# Altium project LIDO_HW_2022_04_V01.PrjPcb (part 2 of 3)

## Sheet LIDO-HW.100.InputStage_2.SchDoc
size A3; SheetNumber: 8; SheetTotal: 17
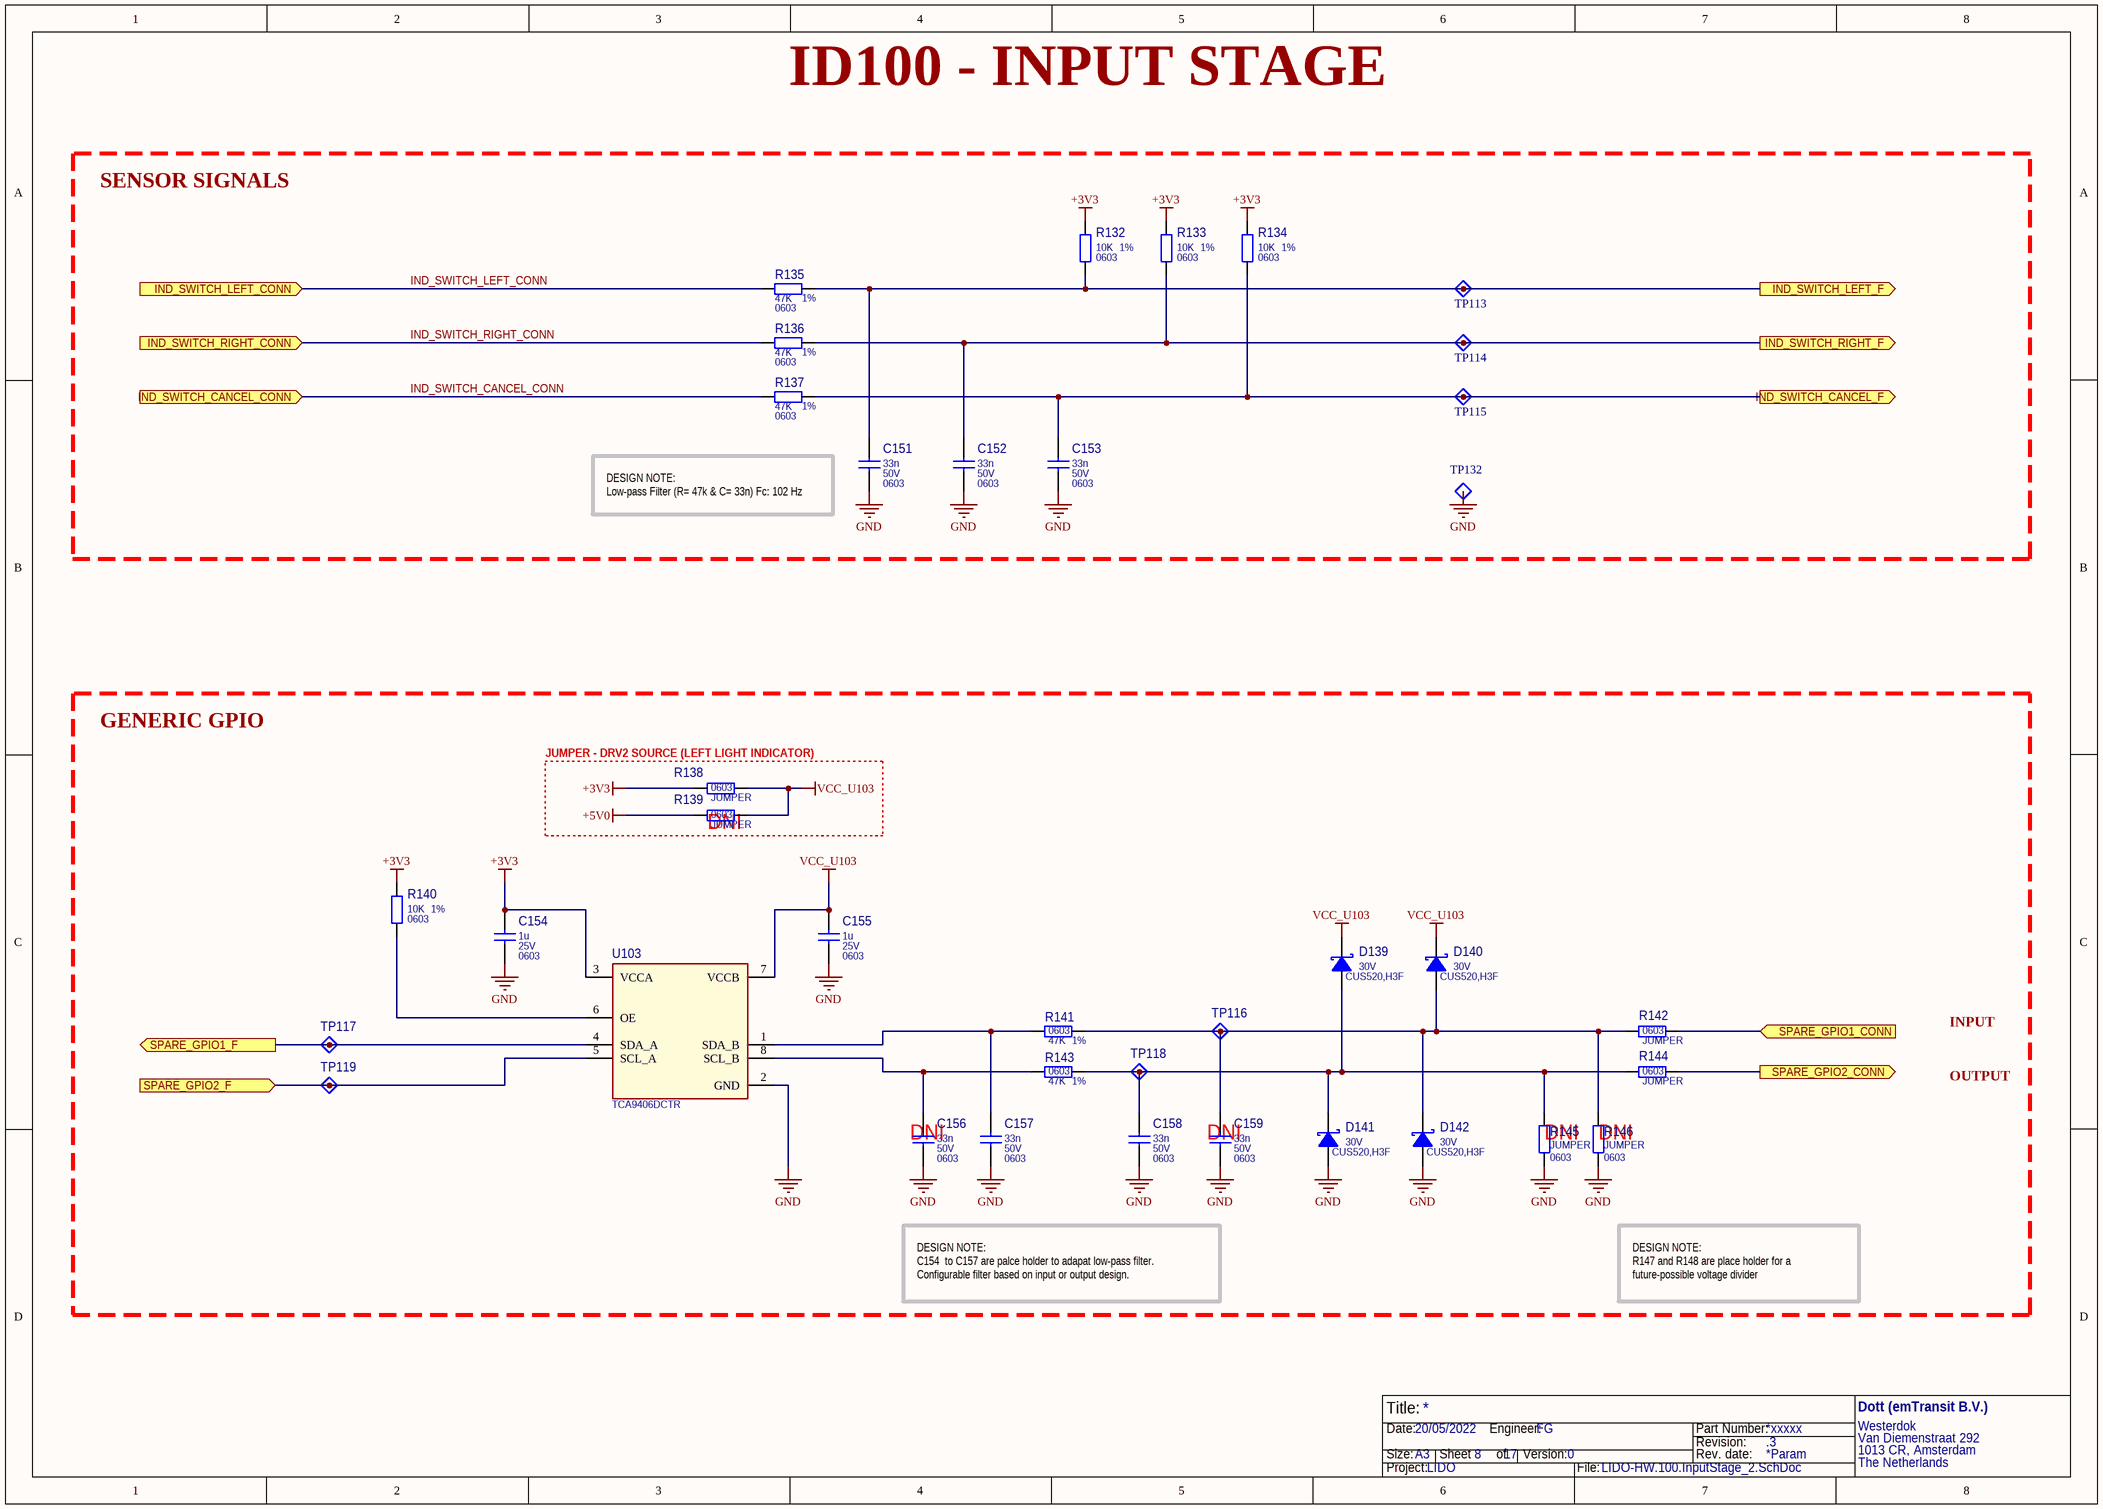
[diagram p7: LIDO-HW.100.InputStage_2.SchDoc]

### Parts
C151  33n  Part Value 2: 50V  Part Package: 0603  [CAP_0603_1608X90-N_MURATA_A]
C152  33n  Part Value 2: 50V  Part Package: 0603  [CAP_0603_1608X90-N_MURATA_A]
C153  33n  Part Value 2: 50V  Part Package: 0603  [CAP_0603_1608X90-N_MURATA_A]
C154  1u  Part Value 2: 25V  Part Package: 0603  [CAP_0603_1608X90-N_MURATA_A]
C155  1u  Part Value 2: 25V  Part Package: 0603  [CAP_0603_1608X90-N_MURATA_A]
C156  33n  Part Value 2: 50V  Part Package: 0603  [CAP_0603_1608X90-N_MURATA_A]
C157  33n  Part Value 2: 50V  Part Package: 0603  [CAP_0603_1608X90-N_MURATA_A]
C158  33n  Part Value 2: 50V  Part Package: 0603  [CAP_0603_1608X90-N_MURATA_A]
C159  33n  Part Value 2: 50V  Part Package: 0603  [CAP_0603_1608X90-N_MURATA_A]
D139  30V  Manufacturer Part Number: CUS520,H3F  [NXP_SOD-323_250X125X95L30x32_A]
D140  30V  Manufacturer Part Number: CUS520,H3F  [NXP_SOD-323_250X125X95L30x32_A]
D141  30V  Manufacturer Part Number: CUS520,H3F  [NXP_SOD-323_250X125X95L30x32_A]
D142  30V  Manufacturer Part Number: CUS520,H3F  [NXP_SOD-323_250X125X95L30x32_A]
R132  10K  Part Value 2: 1%  Part Package: 0603  [RES_0603_1608X60-N_YAGEO_A]
R133  10K  Part Value 2: 1%  Part Package: 0603  [RES_0603_1608X60-N_YAGEO_A]
R134  10K  Part Value 2: 1%  Part Package: 0603  [RES_0603_1608X60-N_YAGEO_A]
R135  47K  Part Value 2: 1%  Part Package: 0603  [RES_0603_1608X60-N_YAGEO_A]
R136  47K  Part Value 2: 1%  Part Package: 0603  [RES_0603_1608X60-N_YAGEO_A]
R137  47K  Part Value 2: 1%  Part Package: 0603  [RES_0603_1608X60-N_YAGEO_A]
R138  JUMPER  Part Package: 0603  [RES_0603_1608X60-N_YAGEO_A]
R139  JUMPER  Part Package: 0603  [RES_0603_1608X60-N_YAGEO_A]
R140  10K  Part Value 2: 1%  Part Package: 0603  [RES_0603_1608X60-N_YAGEO_A]
R141  47K  Part Value 2: 1%  Part Package: 0603  [RES_0603_1608X60-N_YAGEO_A]
R142  JUMPER  Part Package: 0603  [RES_0603_1608X60-N_YAGEO_A]
R143  47K  Part Value 2: 1%  Part Package: 0603  [RES_0603_1608X60-N_YAGEO_A]
R144  JUMPER  Part Package: 0603  [RES_0603_1608X60-N_YAGEO_A]
R145  JUMPER  Part Package: 0603  [RES_0603_1608X60-N_YAGEO_A]
R146  JUMPER  Part Package: 0603  [RES_0603_1608X60-N_YAGEO_A]
TP113  TestPoint_A  [TESTPOINT_1D_A]  (value not drawn)  (no BOM)
TP114  TestPoint_A  [TESTPOINT_1D_A]  (value not drawn)  (no BOM)
TP115  TestPoint_A  [TESTPOINT_1D_A]  (value not drawn)  (no BOM)
TP116  TestPoint_A  [TESTPOINT_1D_A]  (value not drawn)  (no BOM)
TP117  TestPoint_A  [TESTPOINT_1D_A]  (value not drawn)  (no BOM)
TP118  TestPoint_A  [TESTPOINT_1D_A]  (value not drawn)  (no BOM)
TP119  TestPoint_A  [TESTPOINT_1D_A]  (value not drawn)  (no BOM)
TP132  TestPoint_A  [TESTPOINT_1D_A]  (value not drawn)  (no BOM)
U103  TCA9406DCTR  [SSOP8P65_295X400X130L40X25-N_TI_A]

### Blocks framed on the sheet
SENSOR SIGNALS: C151-C153 R132-R137 TP113-TP115 TP132
GENERIC GPIO: C154-C159 D139-D142 R140-R146 TP116-TP119 U103
JUMPER - DRV2 SOURCE (LEFT LIGHT INDICATOR): R138 R139

### Ports
IND_SWITCH_CANCEL_CONN (in), IND_SWITCH_CANCEL_F (out), IND_SWITCH_LEFT_CONN (in), IND_SWITCH_LEFT_F (out), IND_SWITCH_RIGHT_CONN (in), IND_SWITCH_RIGHT_F (out), SPARE_GPIO1_CONN (in), SPARE_GPIO1_F (out), SPARE_GPIO2_CONN (out), SPARE_GPIO2_F (in)

### Nets
+3V3: C154.1 R132.2 R133.2 R134.2 R138.1 R140.2 U103.3(VCCA)
+5V0: R139.1
GND: C151.2 C152.2 C153.2 C154.2 C155.2 C156.2 C157.2 C158.2 C159.2 D141.A D142.A R145.1 R146.1 TP132.1(TP) U103.2(GND)
VCC_U103: C155.1 D139.C D140.C R138.2 R139.2 U103.7(VCCB)
IND_SWITCH_CANCEL_CONN: R137.1 ; port IND_SWITCH_CANCEL_CONN
IND_SWITCH_CANCEL_F: C153.1 R134.1 R137.2 TP115.1(TP) ; port IND_SWITCH_CANCEL_F
IND_SWITCH_LEFT_CONN: R135.1 ; port IND_SWITCH_LEFT_CONN
IND_SWITCH_LEFT_F: C151.1 R132.1 R135.2 TP113.1(TP) ; port IND_SWITCH_LEFT_F
IND_SWITCH_RIGHT_CONN: R136.1 ; port IND_SWITCH_RIGHT_CONN
IND_SWITCH_RIGHT_F: C152.1 R133.1 R136.2 TP114.1(TP) ; port IND_SWITCH_RIGHT_F
SPARE_GPIO1_CONN: R142.2 ; port SPARE_GPIO1_CONN
SPARE_GPIO1_F: TP117.1(TP) U103.4(SDA_A) ; port SPARE_GPIO1_F
SPARE_GPIO2_CONN: R144.2 ; port SPARE_GPIO2_CONN
SPARE_GPIO2_F: TP119.1(TP) U103.5(SCL_A) ; port SPARE_GPIO2_F
NetC156_1: C156.1 R143.1 U103.8(SCL_B)
NetC157_1: C157.1 R141.1 U103.1(SDA_B)
NetC158_1: C158.1 D139.A D141.C R143.2 R144.1 R145.2 TP118.1(TP)
NetC159_1: C159.1 D140.A D142.C R141.2 R142.1 R146.2 TP116.1(TP)
NetR140_1: R140.1 U103.6(OE)

### Notes on the sheet
- ID100 - INPUT STAGE
- DESIGN NOTE:
  Low-pass Filter (R= 47k & C= 33n) Fc: 102 Hz
- INPUT
- OUTPUT
- DESIGN NOTE:
  C154  to C157 are palce holder to adapat low-pass filter.
  Configurable filter based on input or output design.
- DESIGN NOTE:
  R147 and R148 are place holder for a future-possible voltage divider
- Title:
- Size:
- Date:
- A3
- Sheet       of
- Engineer:
- Version:
- Part Number:
- Revision:
- Rev. date:
- Project:
- File:

### Library data of the parts
C151-C153 C156-C159 = 80: CAP CER 0.033UF 50V X7R 0603; Manufacturer Part Number: CGA3E2X7R1H333K080AA; Manufacturer: TDK Corporation; Manufacturer Part Number 2nd: CL10B333KB8WPNC; Manufacturer 2nd: Samsung Electro-Mechanics; Obsolete Part: False; Component ID: 80; Part Value: 33n; Part Value 3: X7R; Package Type: SMT
C154 C155 = 78: CAP CER 1UF 25V X7R 0603; Manufacturer Part Number: CGA3E1X7R1E105M080AE; Manufacturer: TDK Corporation; Obsolete Part: False; Component ID: 78; Part Value: 1u; Part Value 3: X7R; Package Type: SMT
D139-D142 = 17: DIODE SCHOTTKY 30V 200MA; Manufacturer: Toshiba Semiconductor and Storage; Part Package: SOD-323; Obsolete Part: False; Component ID: 17; Part Value: 30V; Part Value 2: 200mA; Package Type: SMT
R132-R134 R140 = 115: RES 10K OHM 1% 1/10W 0603; Manufacturer Part Number: RC0603FR-0710KL; Manufacturer: YAGEO; Obsolete Part: False; Component ID: 115; Part Value: 10K; Part Value 3: 1/10W; Package Type: SMT
R135-R137 R141 R143 = 107: RES SMD 47K OHM 1% 1/10W 0603; Manufacturer Part Number: ERJ-3EKF4702V; Manufacturer: Panasonic Electronic Components; Obsolete Part: False; Component ID: 107; Part Value: 47K; Part Value 3: 1/10W; Package Type: SMT
R138 R139 R142 R144-R146 = 9: RES 0 OHM JUMPER 1/10W 0603; Manufacturer Part Number: RC0603JR-070RL; Manufacturer: YAGEO; Manufacturer Part Number 2nd: RMCF0603ZT0R00; Manufacturer 2nd: Stackpole Electronics Inc; Obsolete Part: False; Component ID: 9; Part Value: JUMPER; Part Value 2: 5%; Part Value 3: 1/10W; Package Type: SMT
TP113-TP119 TP132 = 3: Pad Diamater 1mm; Part: Test Point 1D A; Obsolete Part: False; 00_Name: TP_XXmm; Component ID: 3; 02_Layer: *; 01_Diameter: 1mm
U103 = 6: Voltage Level Translator Bidirectional 1 Circuit 2 Channel 24Mbps SM8; Manufacturer: Texas Instruments; Part Package: MSOP-8; Obsolete Part: False; Component ID: 6; Manufacturer Part Number: TCA9406DCTR; Part Type: Level Translator; Part Value: TCA9406DCTR; Package Type: SMT

## Sheet LIDO-HW.100.OutputStage.SchDoc
size A3; SheetNumber: 9; SheetTotal: 17
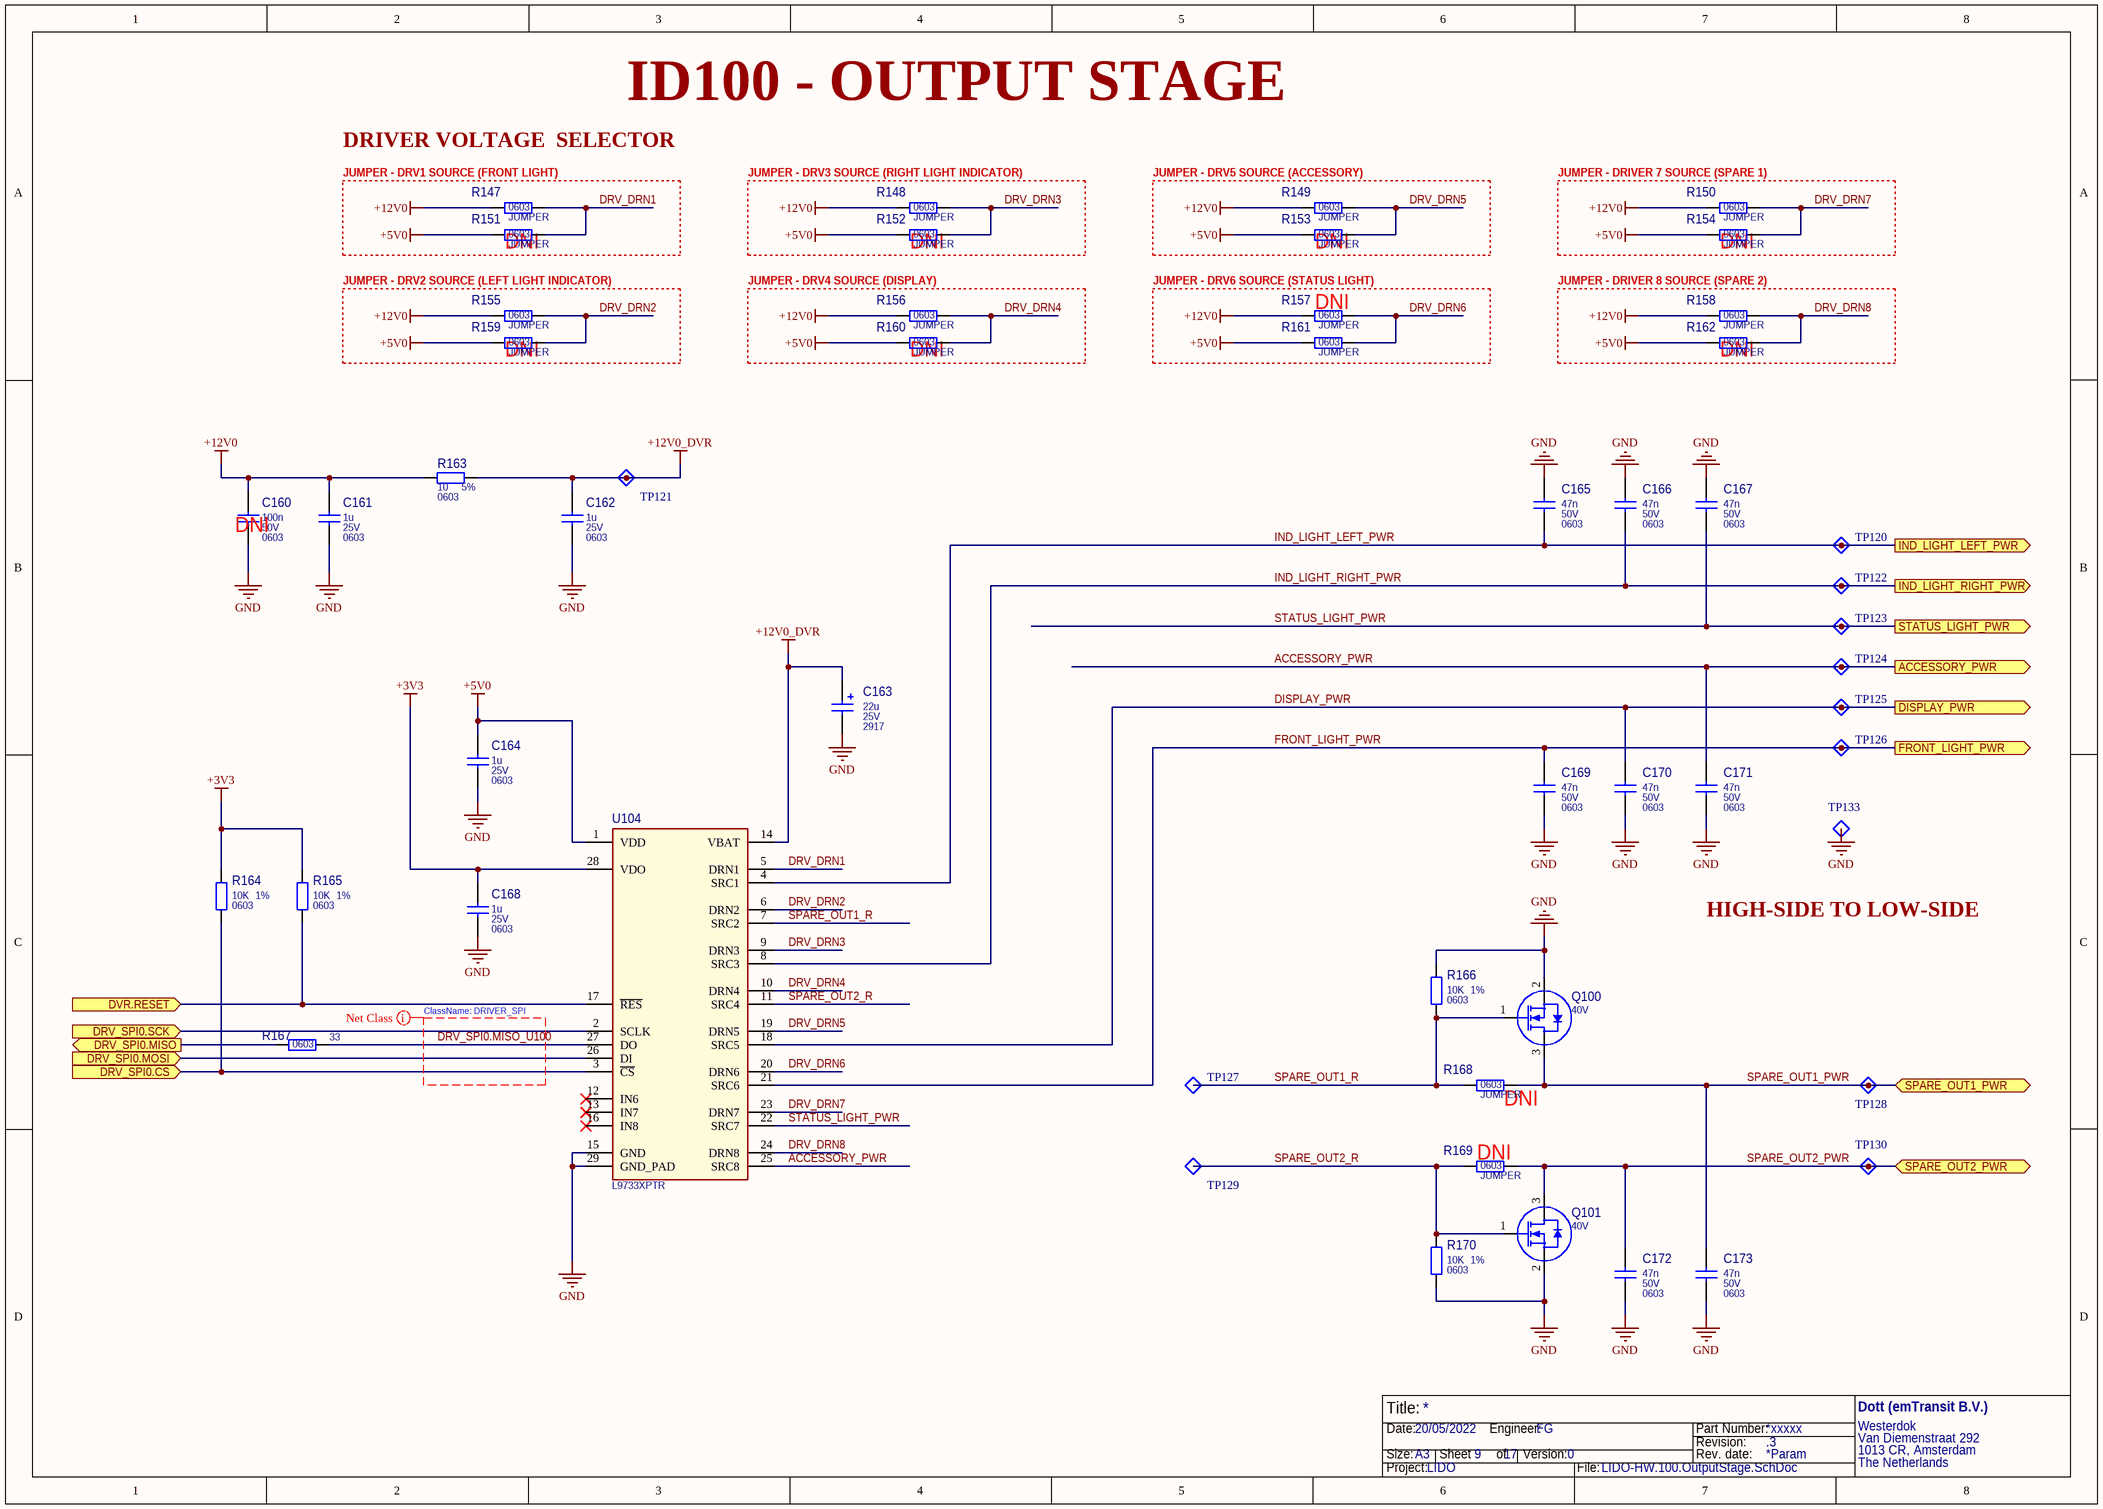
[diagram p8: LIDO-HW.100.OutputStage.SchDoc]

### Parts
C160  100n  Part Value 2: 50V  Part Package: 0603  [CAP_0603_1608X90-N_MURATA_A]
C161  1u  Part Value 2: 25V  Part Package: 0603  [CAP_0603_1608X90-N_MURATA_A]
C162  1u  Part Value 2: 25V  Part Package: 0603  [CAP_0603_1608X90-N_MURATA_A]
C163  22u  Part Value 2: 25V  Part Package: 2917  [CAP_2917_7343X140-N_MURATA_A]
C164  1u  Part Value 2: 25V  Part Package: 0603  [CAP_0603_1608X90-N_MURATA_A]
C165  47n  Part Value 2: 50V  Part Package: 0603  [CAP_0603_1608X90-N_MURATA_A]
C166  47n  Part Value 2: 50V  Part Package: 0603  [CAP_0603_1608X90-N_MURATA_A]
C167  47n  Part Value 2: 50V  Part Package: 0603  [CAP_0603_1608X90-N_MURATA_A]
C168  1u  Part Value 2: 25V  Part Package: 0603  [CAP_0603_1608X90-N_MURATA_A]
C169  47n  Part Value 2: 50V  Part Package: 0603  [CAP_0603_1608X90-N_MURATA_A]
C170  47n  Part Value 2: 50V  Part Package: 0603  [CAP_0603_1608X90-N_MURATA_A]
C171  47n  Part Value 2: 50V  Part Package: 0603  [CAP_0603_1608X90-N_MURATA_A]
C172  47n  Part Value 2: 50V  Part Package: 0603  [CAP_0603_1608X90-N_MURATA_A]
C173  47n  Part Value 2: 50V  Part Package: 0603  [CAP_0603_1608X90-N_MURATA_A]
Q100  40V  [SOT23-3P95_237X112L60-N_ANALOG_A]
Q101  40V  [SOT23-3P95_237X112L60-N_ANALOG_A]
R147  JUMPER  Part Package: 0603  [RES_0603_1608X60-N_YAGEO_A]
R148  JUMPER  Part Package: 0603  [RES_0603_1608X60-N_YAGEO_A]
R149  JUMPER  Part Package: 0603  [RES_0603_1608X60-N_YAGEO_A]
R150  JUMPER  Part Package: 0603  [RES_0603_1608X60-N_YAGEO_A]
R151  JUMPER  Part Package: 0603  [RES_0603_1608X60-N_YAGEO_A]
R152  JUMPER  Part Package: 0603  [RES_0603_1608X60-N_YAGEO_A]
R153  JUMPER  Part Package: 0603  [RES_0603_1608X60-N_YAGEO_A]
R154  JUMPER  Part Package: 0603  [RES_0603_1608X60-N_YAGEO_A]
R155  JUMPER  Part Package: 0603  [RES_0603_1608X60-N_YAGEO_A]
R156  JUMPER  Part Package: 0603  [RES_0603_1608X60-N_YAGEO_A]
R157  JUMPER  Part Package: 0603  [RES_0603_1608X60-N_YAGEO_A]
R158  JUMPER  Part Package: 0603  [RES_0603_1608X60-N_YAGEO_A]
R159  JUMPER  Part Package: 0603  [RES_0603_1608X60-N_YAGEO_A]
R160  JUMPER  Part Package: 0603  [RES_0603_1608X60-N_YAGEO_A]
R161  JUMPER  Part Package: 0603  [RES_0603_1608X60-N_YAGEO_A]
R162  JUMPER  Part Package: 0603  [RES_0603_1608X60-N_YAGEO_A]
R163  10  Part Value 2: 5%  Part Package: 0603  [RES_0603_1608X60-N_YAGEO_A]
R164  10K  Part Value 2: 1%  Part Package: 0603  [RES_0603_1608X60-N_YAGEO_A]
R165  10K  Part Value 2: 1%  Part Package: 0603  [RES_0603_1608X60-N_YAGEO_A]
R166  10K  Part Value 2: 1%  Part Package: 0603  [RES_0603_1608X60-N_YAGEO_A]
R167  33  Part Package: 0603  [RES_0603_1608X60-N_YAGEO_A]
R168  JUMPER  Part Package: 0603  [RES_0603_1608X60-N_YAGEO_A]
R169  JUMPER  Part Package: 0603  [RES_0603_1608X60-N_YAGEO_A]
R170  10K  Part Value 2: 1%  Part Package: 0603  [RES_0603_1608X60-N_YAGEO_A]
TP120  TestPoint_A  [TESTPOINT_1D_A]  (value not drawn)  (no BOM)
TP121  TestPoint_A  [TESTPOINT_1D_A]  (value not drawn)  (no BOM)
TP122  TestPoint_A  [TESTPOINT_1D_A]  (value not drawn)  (no BOM)
TP123  TestPoint_A  [TESTPOINT_1D_A]  (value not drawn)  (no BOM)
TP124  TestPoint_A  [TESTPOINT_1D_A]  (value not drawn)  (no BOM)
TP125  TestPoint_A  [TESTPOINT_1D_A]  (value not drawn)  (no BOM)
TP126  TestPoint_A  [TESTPOINT_1D_A]  (value not drawn)  (no BOM)
TP127  TestPoint_A  [TESTPOINT_1D_A]  (value not drawn)  (no BOM)
TP128  TestPoint_A  [TESTPOINT_1D_A]  (value not drawn)  (no BOM)
TP129  TestPoint_A  [TESTPOINT_1D_A]  (value not drawn)  (no BOM)
TP130  TestPoint_A  [TESTPOINT_1D_A]  (value not drawn)  (no BOM)
TP133  TestPoint_A  [TESTPOINT_1D_A]  (value not drawn)  (no BOM)
U104  L9733XPTR  [SSOP29P65_1030X1030X245L80X27-N_ST_A]

### Blocks framed on the sheet
JUMPER - DRV1 SOURCE (FRONT LIGHT): R147 R151
JUMPER - DRV3 SOURCE (RIGHT LIGHT INDICATOR): R148 R152
JUMPER - DRV5 SOURCE (ACCESSORY): R149 R153
JUMPER - DRIVER 7 SOURCE (SPARE 1): R150 R154
JUMPER - DRV2 SOURCE (LEFT LIGHT INDICATOR): R155 R159
JUMPER - DRV4 SOURCE (DISPLAY): R156 R160
JUMPER - DRV6 SOURCE (STATUS LIGHT): R157 R161
JUMPER - DRIVER 8 SOURCE (SPARE 2): R158 R162

### Ports
ACCESSORY_PWR (out), DISPLAY_PWR (out), DRV_SPI0.CS (in), DRV_SPI0.MISO (out), DRV_SPI0.MOSI (in), DRV_SPI0.SCK (in), DVR.RESET (in), FRONT_LIGHT_PWR (out), IND_LIGHT_LEFT_PWR (out), IND_LIGHT_RIGHT_PWR (out), SPARE_OUT1_PWR (bidir), SPARE_OUT2_PWR (bidir), STATUS_LIGHT_PWR (out)

### Nets
+3V3: C168.1 R164.2 R165.2 U104.28(VDO)
+5V0: C164.1 R151.1 R152.1 R153.1 R154.1 R159.1 R160.1 R161.1 R162.1 U104.1(VDD)
+12V0: C160.2 C161.1 R147.1 R148.1 R149.1 R150.1 R155.1 R156.1 R157.1 R158.1 R163.1
+12V0_DVR: C162.1 C163.1 R163.2 TP121.1(TP) U104.14(VBAT)
GND: C160.1 C161.2 C162.2 C163.2 C164.2 C165.1 C166.1 C167.1 C168.2 C169.2 C170.2 C171.2 C172.2 C173.2 Q100.2(S) Q101.2(S) R166.2 R170.1 TP133.1(TP) U104.15(GND) U104.29(GND_PAD)
ACCESSORY_PWR: C171.1 TP124.1(TP) U104.25(SRC8) ; port ACCESSORY_PWR
DISPLAY_PWR: C170.1 TP125.1(TP) U104.18(SRC5) ; port DISPLAY_PWR
DRV_DRN1: R147.2 R151.2 U104.5(DRN1)
DRV_DRN2: R155.2 R159.2 U104.6(DRN2)
DRV_DRN3: R148.2 R152.2 U104.9(DRN3)
DRV_DRN4: R156.2 R160.2 U104.10(DRN4)
DRV_DRN5: R149.2 R153.2 U104.19(DRN5)
DRV_DRN6: R157.2 R161.2 U104.20(DRN6)
DRV_DRN7: R150.2 R154.2 U104.23(DRN7)
DRV_DRN8: R158.2 R162.2 U104.24(DRN8)
DRV_SPI0.CS: R164.1 U104.3(~{CS}) ; port DRV_SPI0.CS
DRV_SPI0.MISO: R167.1 ; port DRV_SPI0.MISO
DRV_SPI0.MISO_U100: R167.2 U104.27(DO)
DRV_SPI0.MOSI: U104.26(DI) ; port DRV_SPI0.MOSI
DRV_SPI0.SCK: U104.2(SCLK) ; port DRV_SPI0.SCK
DVR.RESET: R165.1 U104.17(~{RES}) ; port DVR.RESET
FRONT_LIGHT_PWR: C169.1 TP126.1(TP) U104.21(SRC6) ; port FRONT_LIGHT_PWR
IND_LIGHT_LEFT_PWR: C165.2 TP120.1(TP) U104.4(SRC1) ; port IND_LIGHT_LEFT_PWR
IND_LIGHT_RIGHT_PWR: C166.2 TP122.1(TP) U104.8(SRC3) ; port IND_LIGHT_RIGHT_PWR
SPARE_OUT1_PWR: C173.1 Q100.3(D) R168.2 TP128.1(TP) ; port SPARE_OUT1_PWR
SPARE_OUT1_R: Q100.1(G) R166.1 R168.1 TP127.1(TP) U104.7(SRC2)
SPARE_OUT2_PWR: C172.1 Q101.3(D) R169.2 TP130.1(TP) ; port SPARE_OUT2_PWR
SPARE_OUT2_R: Q101.1(G) R169.1 R170.2 TP129.1(TP) U104.11(SRC4)
STATUS_LIGHT_PWR: C167.2 TP123.1(TP) U104.22(SRC7) ; port STATUS_LIGHT_PWR

Not connected (* = marked no-connect by the designer): U104 12(IN6)* 13(IN7)* 16(IN8)*

### Layout directives
net class DRIVER_SPI: DRV_SPI0.MISO_U100

### Notes on the sheet
- ID100 - OUTPUT STAGE
- DRIVER VOLTAGE  SELECTOR
- HIGH-SIDE TO LOW-SIDE
- ClassName: DRIVER_SPI
- Title:
- Size:
- Date:
- A3
- Sheet       of
- Engineer:
- Version:
- Part Number:
- Revision:
- Rev. date:
- Project:
- File:

### Library data of the parts
C160 = 77: CAP CER 0.1UF 50V X7R 0603; Manufacturer Part Number: CGA3E2X7R1H104K080AA; Manufacturer: TDK Corporation; Obsolete Part: False; Component ID: 77; Part Value: 100n; Part Value 3: X7R; Package Type: SMT
C161 C162 C164 C168 = 78: as C154 on sheet LIDO-HW.100.InputStage_2; Part Value: 1u; Part Value 3: X7R; Package Type: SMT
C163 = 87: CAP ALUM POLY 22UF 20% 25V SMD; Manufacturer Part Number: ECASD31E226M040KA0; Manufacturer: Murata Electronics; Obsolete Part: False; Component ID: 87; Part Value: 22u; Part Value 3: 20%; Package Type: SMT
C165-C167 C169-C173 = 81: CAP CER 0.047UF 50V X7R 0603; Manufacturer Part Number: GCM188R71H473KA55D; Manufacturer: Murata Electronics; Manufacturer Part Number 2nd: CGA3E2X7R1H473M080AA; Manufacturer 2nd: TDK Corporation; Obsolete Part: False; Component ID: 81; Part Value: 47n; Part Value 3: X7R; Package Type: SMT
Q100 Q101 = 20: MOSFET N-CH 40V 4.6A SOT23; Manufacturer Part Number: DMN4035LQ-13; Manufacturer: Diodes Incorporated; Part Package: SOT23-3; Obsolete Part: False; Component ID: 20; Part Value: 40V; Part Value 2: 40V; Package Type: SMT
R147-R162 R168 R169 = 9: as R138 on sheet LIDO-HW.100.InputStage_2; Part Value: JUMPER; Part Value 2: 5%; Part Value 3: 1/10W; Package Type: SMT
R163 = 109: RES SMD 10 OHM 5% 1/4W 0603; Manufacturer Part Number: ESR03EZPJ100; Manufacturer: Rohm Semiconductor; Obsolete Part: False; Component ID: 109; Part Value: 10; Part Value 3: 1/10W; Package Type: SMT
R164-R166 R170 = 115: as R132-R134 on sheet LIDO-HW.100.InputStage_2; Part Value: 10K; Part Value 3: 1/10W; Package Type: SMT
R167 = 121: RES 33 OHM 5% 1/10W 0603; Manufacturer Part Number: RC0603JR-0733RL; Manufacturer: YAGEO; Obsolete Part: False; Component ID: 121; Part Value: 33; Part Value 2: 5%; Part Value 3: 1/10W; Package Type: SMT
TP120-TP130 TP133 = 3: as TP113-TP119 on sheet LIDO-HW.100.InputStage_2; 02_Layer: *; 01_Diameter: 1mm
U104 = 35: Power Switch/Driver 1:8 N-Channel 1A PowerSSO-28 Exposed Pad; Manufacturer: STMicroelectronics; Part Package: PSSOP-28; Obsolete Part: False; Component ID: 35; Manufacturer Part Number: L9733XPTR; Part Type: Power Switch; Package Type: SMT

## Sheet LIDO-HW.200.MCU_Peripherals_1.SchDoc
size A3; SheetNumber: 10; SheetTotal: 17
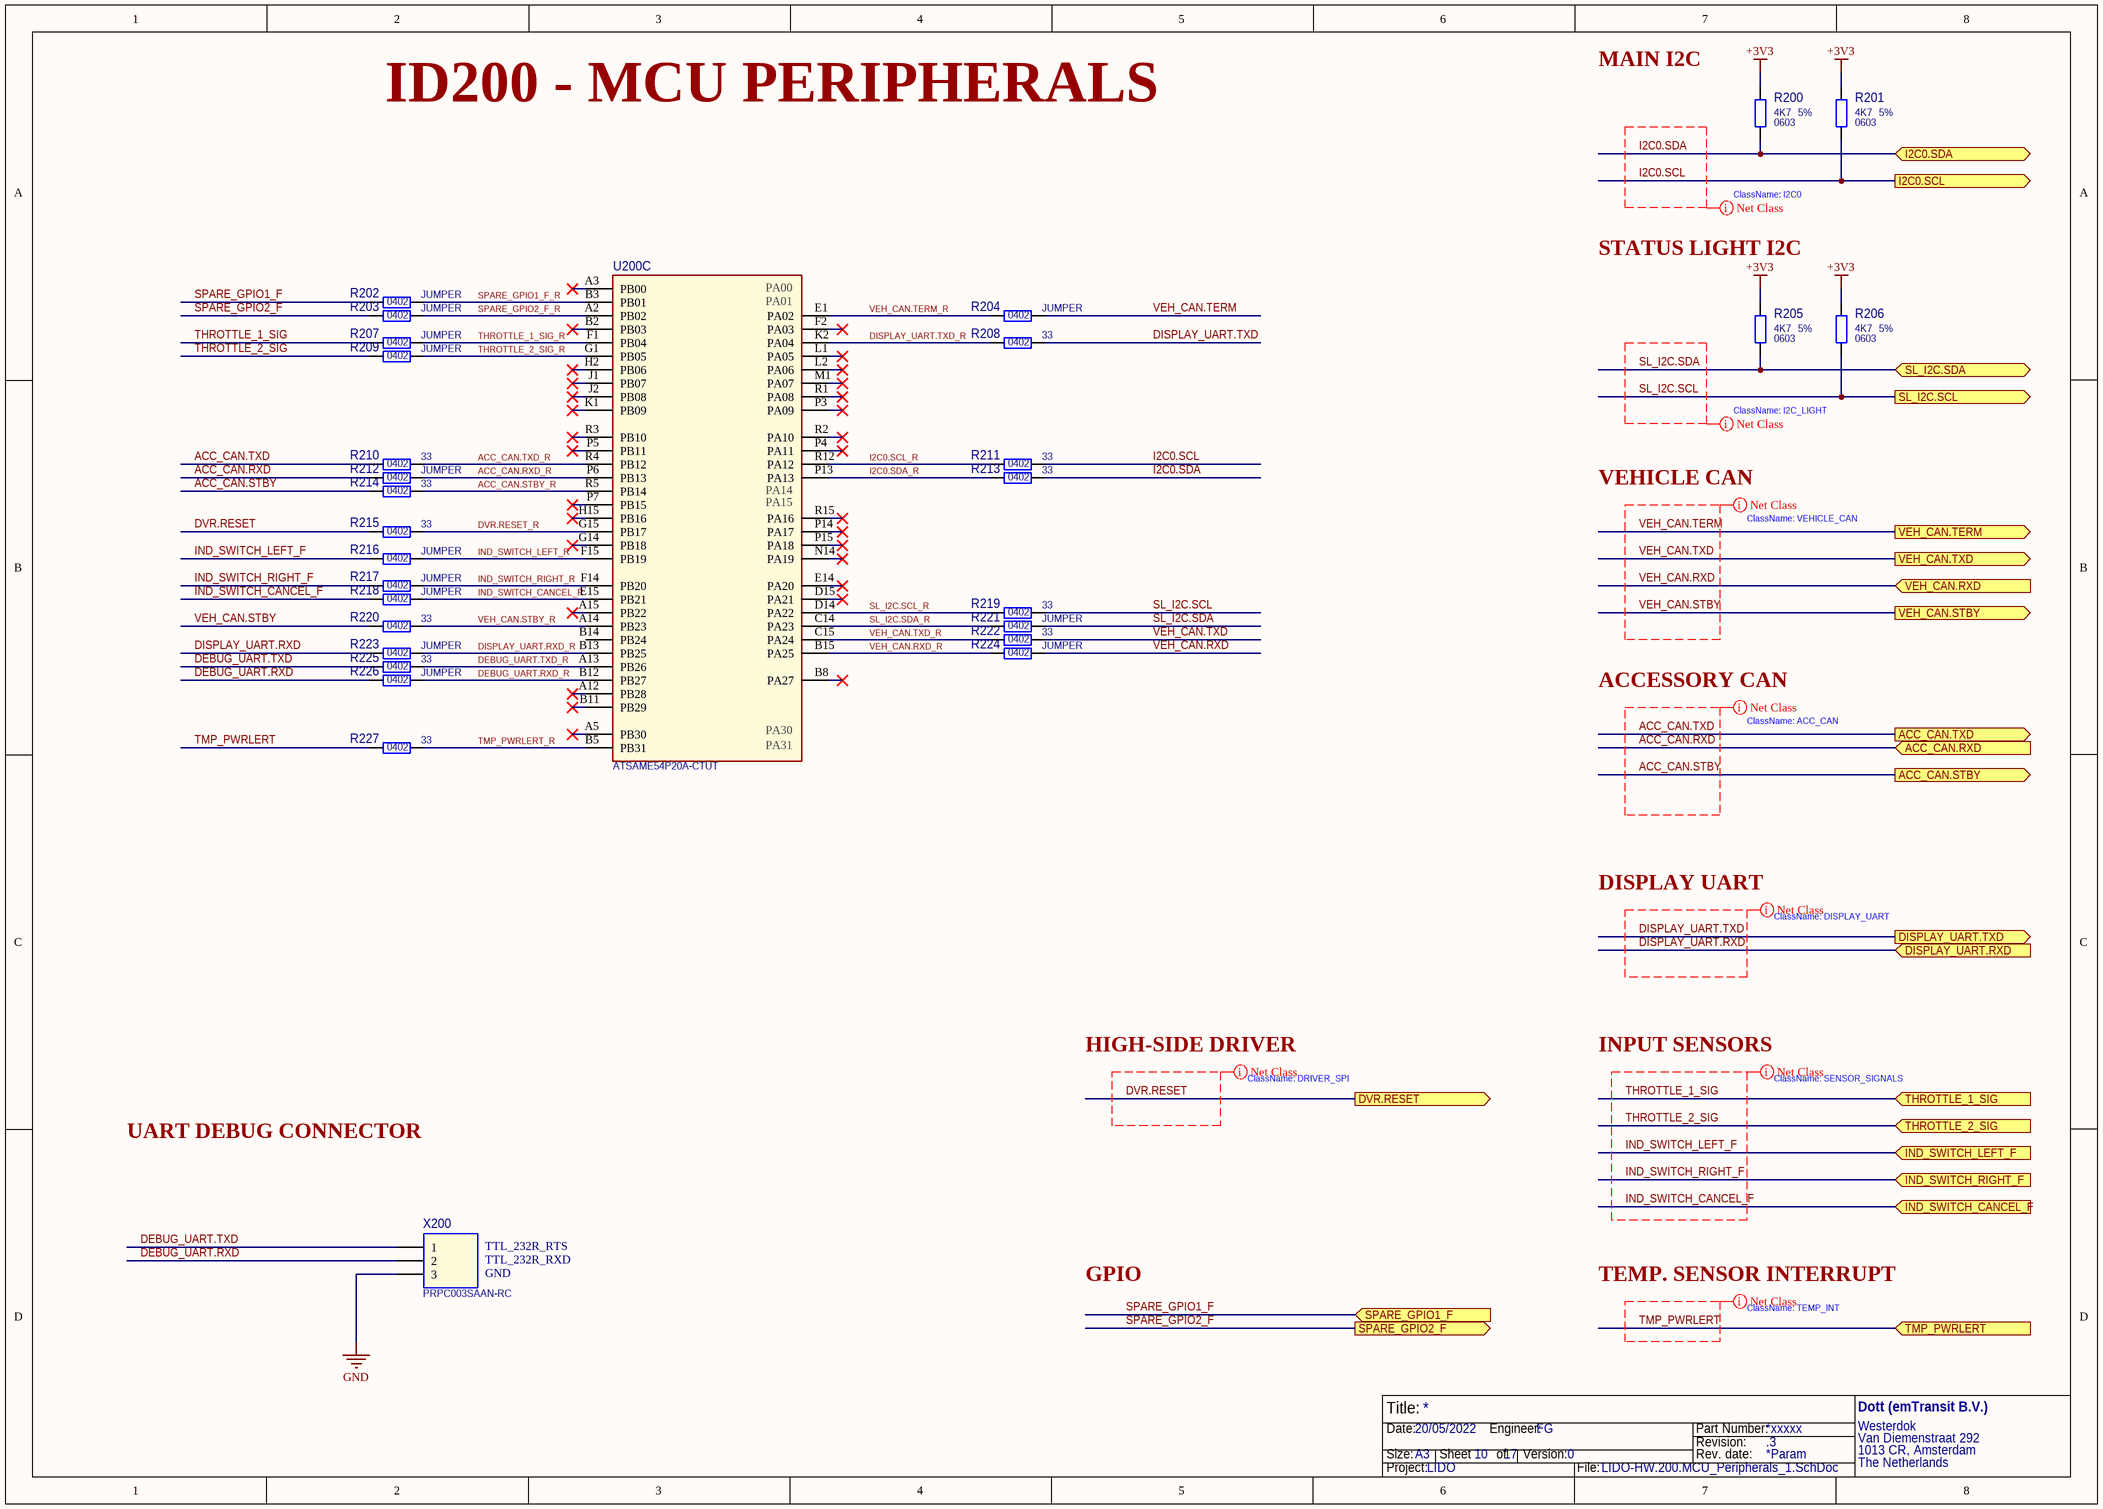
[diagram p9: LIDO-HW.200.MCU_Peripherals_1.SchDoc]

### Parts
R200  4K7  Part Value 2: 5%  Part Package: 0603  [RES_0603_1608X60-N_YAGEO_A]
R201  4K7  Part Value 2: 5%  Part Package: 0603  [RES_0603_1608X60-N_YAGEO_A]
R202  JUMPER  Part Package: 0402  [RES_0402_1005X40-N_YAGEO_A]
R203  JUMPER  Part Package: 0402  [RES_0402_1005X40-N_YAGEO_A]
R204  JUMPER  Part Package: 0402  [RES_0402_1005X40-N_YAGEO_A]
R205  4K7  Part Value 2: 5%  Part Package: 0603  [RES_0603_1608X60-N_YAGEO_A]
R206  4K7  Part Value 2: 5%  Part Package: 0603  [RES_0603_1608X60-N_YAGEO_A]
R207  JUMPER  Part Package: 0402  [RES_0402_1005X40-N_YAGEO_A]
R208  33  Part Package: 0402  [RES_0402_1005X40-N_YAGEO_A]
R209  JUMPER  Part Package: 0402  [RES_0402_1005X40-N_YAGEO_A]
R210  33  Part Package: 0402  [RES_0402_1005X40-N_YAGEO_A]
R211  33  Part Package: 0402  [RES_0402_1005X40-N_YAGEO_A]
R212  JUMPER  Part Package: 0402  [RES_0402_1005X40-N_YAGEO_A]
R213  33  Part Package: 0402  [RES_0402_1005X40-N_YAGEO_A]
R214  33  Part Package: 0402  [RES_0402_1005X40-N_YAGEO_A]
R215  33  Part Package: 0402  [RES_0402_1005X40-N_YAGEO_A]
R216  JUMPER  Part Package: 0402  [RES_0402_1005X40-N_YAGEO_A]
R217  JUMPER  Part Package: 0402  [RES_0402_1005X40-N_YAGEO_A]
R218  JUMPER  Part Package: 0402  [RES_0402_1005X40-N_YAGEO_A]
R219  33  Part Package: 0402  [RES_0402_1005X40-N_YAGEO_A]
R220  33  Part Package: 0402  [RES_0402_1005X40-N_YAGEO_A]
R221  JUMPER  Part Package: 0402  [RES_0402_1005X40-N_YAGEO_A]
R222  33  Part Package: 0402  [RES_0402_1005X40-N_YAGEO_A]
R223  JUMPER  Part Package: 0402  [RES_0402_1005X40-N_YAGEO_A]
R224  JUMPER  Part Package: 0402  [RES_0402_1005X40-N_YAGEO_A]
R225  33  Part Package: 0402  [RES_0402_1005X40-N_YAGEO_A]
R226  JUMPER  Part Package: 0402  [RES_0402_1005X40-N_YAGEO_A]
R227  33  Part Package: 0402  [RES_0402_1005X40-N_YAGEO_A]
U200  ATSAME54P20A-CTUT  [BGA120CP50_15X15_800X800X120B25-N_MICROCHIP_A]  (part C of 4)
X200  PRPC003SAAN-RC  [HDR_3POS_1X3-N_WURTH_A]

### Ports
ACC_CAN.RXD (in), ACC_CAN.STBY (out), ACC_CAN.TXD (out), DISPLAY_UART.RXD (in), DISPLAY_UART.TXD (out), DVR.RESET (out), I2C0.SCL (out), I2C0.SDA (bidir), IND_SWITCH_CANCEL_F (in), IND_SWITCH_LEFT_F (in), IND_SWITCH_RIGHT_F (in), SL_I2C.SCL (out), SL_I2C.SDA (bidir), SPARE_GPIO1_F (in), SPARE_GPIO2_F (out), THROTTLE_1_SIG (in), THROTTLE_2_SIG (in), TMP_PWRLERT (in), VEH_CAN.RXD (in), VEH_CAN.STBY (out), VEH_CAN.TERM (out), VEH_CAN.TXD (out)

### Nets
+3V3: R200.2 R201.2 R205.2 R206.2
GND: X200.3
ACC_CAN.RXD: R212.1 ; port ACC_CAN.RXD
ACC_CAN.RXD_R: R212.2 U200.P6(PB13)
ACC_CAN.STBY: R214.1 ; port ACC_CAN.STBY
ACC_CAN.STBY_R: R214.2 U200.R5(PB14)
ACC_CAN.TXD: R210.1 ; port ACC_CAN.TXD
ACC_CAN.TXD_R: R210.2 U200.R4(PB12)
DEBUG_UART.RXD: R226.1 X200.2
DEBUG_UART.RXD_R: R226.2 U200.B12(PB27)
DEBUG_UART.TXD: R225.1 X200.1
DEBUG_UART.TXD_R: R225.2 U200.A13(PB26)
DISPLAY_UART.RXD: R223.1 ; port DISPLAY_UART.RXD
DISPLAY_UART.RXD_R: R223.2 U200.B13(PB25)
DISPLAY_UART.TXD: R208.2 ; port DISPLAY_UART.TXD
DISPLAY_UART.TXD_R: R208.1 U200.K2(PA04)
DVR.RESET: R215.1 ; port DVR.RESET
DVR.RESET_R: R215.2 U200.G15(PB17)
I2C0.SCL: R201.1 R211.2 ; port I2C0.SCL
I2C0.SCL_R: R211.1 U200.R12(PA12)
I2C0.SDA: R200.1 R213.2 ; port I2C0.SDA
I2C0.SDA_R: R213.1 U200.P13(PA13)
IND_SWITCH_CANCEL_F: R218.1 ; port IND_SWITCH_CANCEL_F
IND_SWITCH_CANCEL_R: R218.2 U200.E15(PB21)
IND_SWITCH_LEFT_F: R216.1 ; port IND_SWITCH_LEFT_F
IND_SWITCH_LEFT_R: R216.2 U200.F15(PB19)
IND_SWITCH_RIGHT_F: R217.1 ; port IND_SWITCH_RIGHT_F
IND_SWITCH_RIGHT_R: R217.2 U200.F14(PB20)
SL_I2C.SCL: R206.1 R219.2 ; port SL_I2C.SCL
SL_I2C.SCL_R: R219.1 U200.D14(PA22)
SL_I2C.SDA: R205.1 R221.2 ; port SL_I2C.SDA
SL_I2C.SDA_R: R221.1 U200.C14(PA23)
SPARE_GPIO1_F: R202.1 ; port SPARE_GPIO1_F
SPARE_GPIO1_F_R: R202.2 U200.B3(PB01)
SPARE_GPIO2_F: R203.1 ; port SPARE_GPIO2_F
SPARE_GPIO2_F_R: R203.2 U200.A2(PB02)
THROTTLE_1_SIG: R207.1 ; port THROTTLE_1_SIG
THROTTLE_1_SIG_R: R207.2 U200.F1(PB04)
THROTTLE_2_SIG: R209.1 ; port THROTTLE_2_SIG
THROTTLE_2_SIG_R: R209.2 U200.G1(PB05)
TMP_PWRLERT: R227.1 ; port TMP_PWRLERT
TMP_PWRLERT_R: R227.2 U200.B5(PB31)
VEH_CAN.RXD: R224.2 ; port VEH_CAN.RXD
VEH_CAN.RXD_R: R224.1 U200.B15(PA25)
VEH_CAN.STBY: R220.1 ; port VEH_CAN.STBY
VEH_CAN.STBY_R: R220.2 U200.A14(PB23)
VEH_CAN.TERM: R204.2 ; port VEH_CAN.TERM
VEH_CAN.TERM_R: R204.1 U200.E1(PA02)
VEH_CAN.TXD: R222.2 ; port VEH_CAN.TXD
VEH_CAN.TXD_R: R222.1 U200.C15(PA24)

Not connected (* = marked no-connect by the designer): U200 A3(PB00)* A5(PB30)* A12(PB28)* A15(PB22)* B2(PB03)* B8(PA27)* B11(PB29)* B14(PB24) D15(PA21)* E14(PA20)* F2(PA03)* G14(PB18)* H2(PB06)* H15(PB16)* J1(PB07)* J2(PB08)* K1(PB09)* L1(PA05)* L2(PA06)* M1(PA07)* N14(PA19)* P3(PA09)* P4(PA11)* P5(PB11)* P7(PB15)* P14(PA17)* P15(PA18)* R1(PA08)* R2(PA10)* R3(PB10)* R15(PA16)*

### Layout directives
net class I2C0: I2C0.SCL, I2C0.SDA
net class VEHICLE_CAN: VEH_CAN.RXD, VEH_CAN.STBY, VEH_CAN.TERM, VEH_CAN.TXD
net class ACC_CAN: ACC_CAN.RXD, ACC_CAN.STBY, ACC_CAN.TXD
net class I2C1_LIGHT: SL_I2C.SCL, SL_I2C.SDA
net class TEMP_INT: TMP_PWRLERT
net class DISPLAY_UART: DISPLAY_UART.RXD, DISPLAY_UART.TXD
net class DRIVER_SPI: DVR.RESET
net class SENSOR_SIGNALS: IND_SWITCH_CANCEL_F, IND_SWITCH_LEFT_F, IND_SWITCH_RIGHT_F, THROTTLE_1_SIG, THROTTLE_2_SIG

### Notes on the sheet
- ID200 - MCU PERIPHERALS
- MAIN I2C
- ClassName: I2C0
- STATUS LIGHT I2C
- ClassName: I2C_LIGHT
- VEHICLE CAN
- ClassName: VEHICLE_CAN
- ACCESSORY CAN
- ClassName: ACC_CAN
- DISPLAY UART
- ClassName: DISPLAY_UART
- HIGH-SIDE DRIVER
- INPUT SENSORS
- ClassName: DRIVER_SPI
- ClassName: SENSOR_SIGNALS
- UART DEBUG CONNECTOR
- TTL_232R_RXD
- TTL_232R_RTS
- GND
- GPIO
- TEMP. SENSOR INTERRUPT
- ClassName: TEMP_INT
- Title:
- Size:
- Date:
- A3
- Sheet       of
- Engineer:
- Version:
- Part Number:
- Revision:
- Rev. date:
- Project:
- File:
- (in symbol 10, part C) PA00; PA01; PA14; PA15; PA30; PA31

### Library data of the parts
R200 R201 R205 R206 = 119: RES 4.7K OHM 5% 1/10W 0603; Manufacturer Part Number: RC0603JR-074K7L; Manufacturer: YAGEO; Obsolete Part: False; Component ID: 119; Part Value: 4K7; Part Value 3: 1/10W; Package Type: SMT
R202-R204 R207 R209 R212 R216-R218 R221 R223 R224 R226 = 127: RES SMD 0 OHM JUMPER 1/10W 0402; Manufacturer Part Number: ERJ-2GE0R00X; Manufacturer: Panasonic Electronic Components; Obsolete Part: False; Component ID: 127; Part Value: JUMPER; Part Value 3: 1/10W; Package Type: SMT
R208 R210 R211 R213-R215 R219 R220 R222 R225 R227 = 111: RES SMD 33 OHM 5% 1/10W 0402; Manufacturer Part Number: ERJ-2GEJ330X; Manufacturer: Panasonic Electronic Components; Obsolete Part: False; Component ID: 111; Part Value: 33; Part Value 2: 5%; Part Value 3: 1/10W; Package Type: SMT
U200 = 10: ARM® Cortex®-M4F series Microcontroller IC 32-Bit Single-Core 120MHz 1MB (1M x 8) FLASH 120-TFBGA (8x8); Manufacturer: Microchip Technology; Part Package: TFBGA-120; Obsolete Part: False; Component ID: 10; Manufacturer Part Number: ATSAME54P20A-CTUT; Part Type: MCU M4; Package Type: SMT
X200 = 53: CONN HEADER VERT 3POS 2.54MM; Manufacturer: Sullins Connector Solutions; Part Value: 3-Pins; Obsolete Part: False; Component ID: 53; Manufacturer Part Number: PRPC003SAAN-RC; Part Pitch: 2.54mm

## Sheet LIDO-HW.200.MCU_Peripherals_2.SchDoc
size A3; SheetNumber: 11; SheetTotal: 17
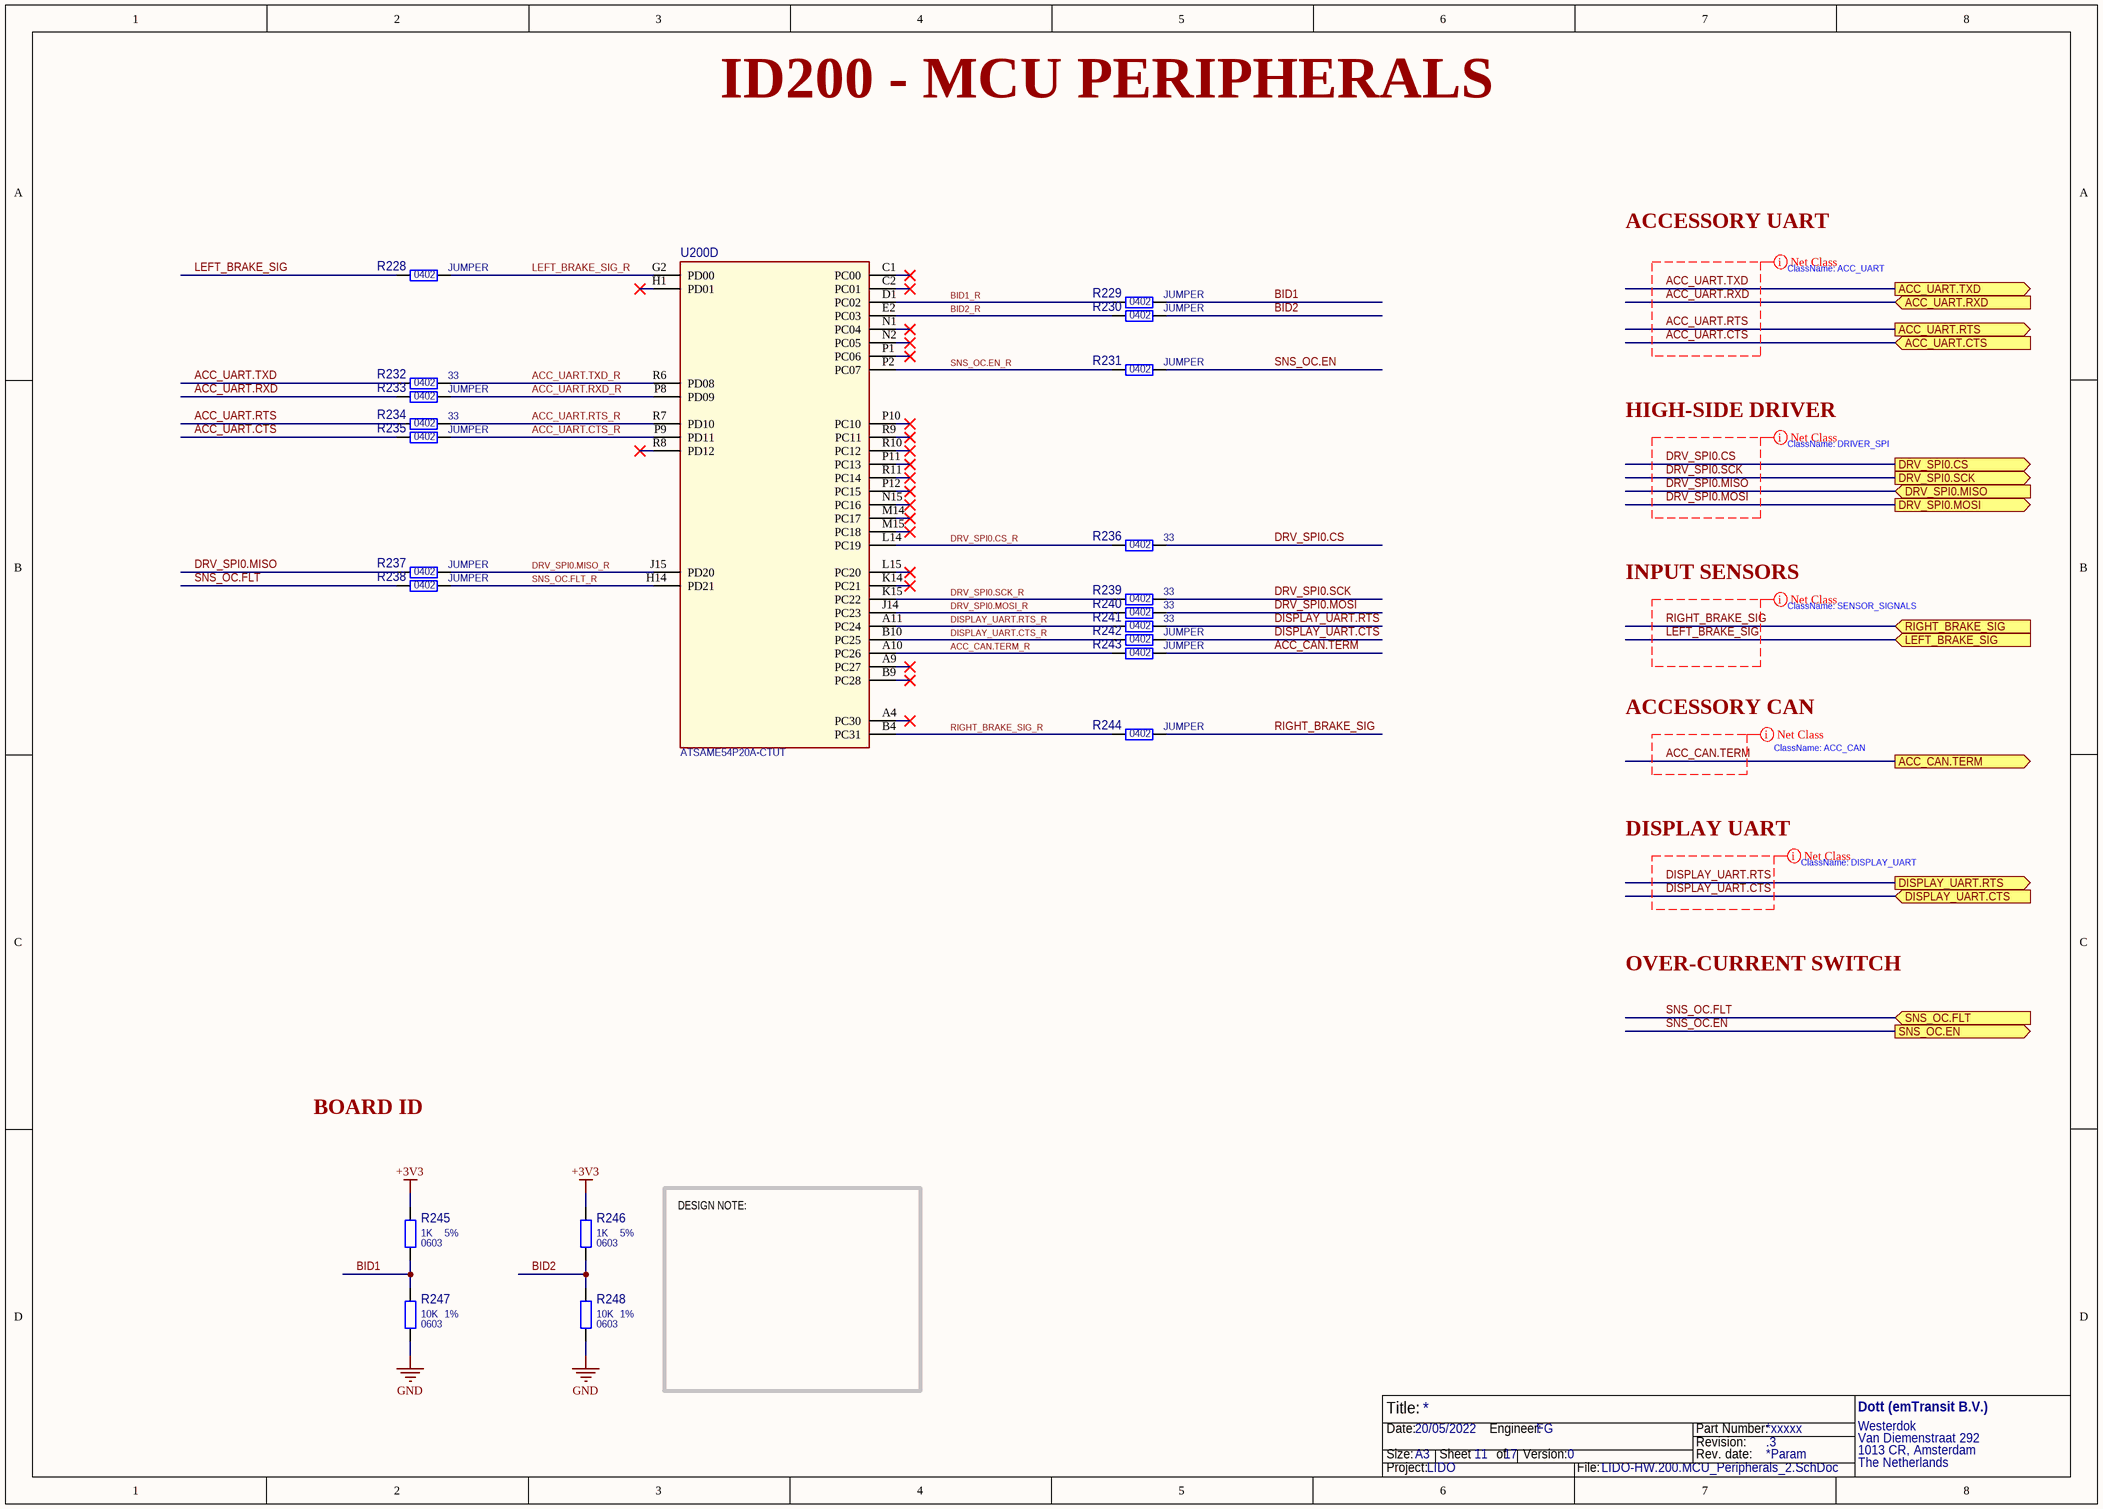
[diagram p10: LIDO-HW.200.MCU_Peripherals_2.SchDoc]

### Parts
R228  JUMPER  Part Package: 0402  [RES_0402_1005X40-N_YAGEO_A]
R229  JUMPER  Part Package: 0402  [RES_0402_1005X40-N_YAGEO_A]
R230  JUMPER  Part Package: 0402  [RES_0402_1005X40-N_YAGEO_A]
R231  JUMPER  Part Package: 0402  [RES_0402_1005X40-N_YAGEO_A]
R232  33  Part Package: 0402  [RES_0402_1005X40-N_YAGEO_A]
R233  JUMPER  Part Package: 0402  [RES_0402_1005X40-N_YAGEO_A]
R234  33  Part Package: 0402  [RES_0402_1005X40-N_YAGEO_A]
R235  JUMPER  Part Package: 0402  [RES_0402_1005X40-N_YAGEO_A]
R236  33  Part Package: 0402  [RES_0402_1005X40-N_YAGEO_A]
R237  JUMPER  Part Package: 0402  [RES_0402_1005X40-N_YAGEO_A]
R238  JUMPER  Part Package: 0402  [RES_0402_1005X40-N_YAGEO_A]
R239  33  Part Package: 0402  [RES_0402_1005X40-N_YAGEO_A]
R240  33  Part Package: 0402  [RES_0402_1005X40-N_YAGEO_A]
R241  33  Part Package: 0402  [RES_0402_1005X40-N_YAGEO_A]
R242  JUMPER  Part Package: 0402  [RES_0402_1005X40-N_YAGEO_A]
R243  JUMPER  Part Package: 0402  [RES_0402_1005X40-N_YAGEO_A]
R244  JUMPER  Part Package: 0402  [RES_0402_1005X40-N_YAGEO_A]
R245  1K  Part Value 2: 5%  Part Package: 0603  [RES_0603_1608X60-N_YAGEO_A]
R246  1K  Part Value 2: 5%  Part Package: 0603  [RES_0603_1608X60-N_YAGEO_A]
R247  10K  Part Value 2: 1%  Part Package: 0603  [RES_0603_1608X60-N_YAGEO_A]
R248  10K  Part Value 2: 1%  Part Package: 0603  [RES_0603_1608X60-N_YAGEO_A]
U200  ATSAME54P20A-CTUT  [BGA120CP50_15X15_800X800X120B25-N_MICROCHIP_A]  (part D of 4)

### Ports
ACC_CAN.TERM (out), ACC_UART.CTS (in), ACC_UART.RTS (out), ACC_UART.RXD (in), ACC_UART.TXD (out), DISPLAY_UART.CTS (in), DISPLAY_UART.RTS (out), DRV_SPI0.CS (out), DRV_SPI0.MISO (in), DRV_SPI0.MOSI (out), DRV_SPI0.SCK (out), LEFT_BRAKE_SIG (in), RIGHT_BRAKE_SIG (in), SNS_OC.EN (out), SNS_OC.FLT (in)

### Nets
+3V3: R245.2 R246.2
GND: R247.1 R248.1
ACC_CAN.TERM: R243.2 ; port ACC_CAN.TERM
ACC_CAN.TERM_R: R243.1 U200.A10(PC26)
ACC_UART.CTS: R235.1 ; port ACC_UART.CTS
ACC_UART.CTS_R: R235.2 U200.P9(PD11)
ACC_UART.RTS: R234.1 ; port ACC_UART.RTS
ACC_UART.RTS_R: R234.2 U200.R7(PD10)
ACC_UART.RXD: R233.1 ; port ACC_UART.RXD
ACC_UART.RXD_R: R233.2 U200.P8(PD09)
ACC_UART.TXD: R232.1 ; port ACC_UART.TXD
ACC_UART.TXD_R: R232.2 U200.R6(PD08)
BID1: R229.2 R245.1 R247.2
BID1_R: R229.1 U200.D1(PC02)
BID2: R230.2 R246.1 R248.2
BID2_R: R230.1 U200.E2(PC03)
DISPLAY_UART.CTS: R242.2 ; port DISPLAY_UART.CTS
DISPLAY_UART.CTS_R: R242.1 U200.B10(PC25)
DISPLAY_UART.RTS: R241.2 ; port DISPLAY_UART.RTS
DISPLAY_UART.RTS_R: R241.1 U200.A11(PC24)
DRV_SPI0.CS: R236.2 ; port DRV_SPI0.CS
DRV_SPI0.CS_R: R236.1 U200.L14(PC19)
DRV_SPI0.MISO: R237.1 ; port DRV_SPI0.MISO
DRV_SPI0.MISO_R: R237.2 U200.J15(PD20)
DRV_SPI0.MOSI: R240.2 ; port DRV_SPI0.MOSI
DRV_SPI0.MOSI_R: R240.1 U200.J14(PC23)
DRV_SPI0.SCK: R239.2 ; port DRV_SPI0.SCK
DRV_SPI0.SCK_R: R239.1 U200.K15(PC22)
LEFT_BRAKE_SIG: R228.1 ; port LEFT_BRAKE_SIG
LEFT_BRAKE_SIG_R: R228.2 U200.G2(PD00)
RIGHT_BRAKE_SIG: R244.2 ; port RIGHT_BRAKE_SIG
RIGHT_BRAKE_SIG_R: R244.1 U200.B4(PC31)
SNS_OC.EN: R231.2 ; port SNS_OC.EN
SNS_OC.EN_R: R231.1 U200.P2(PC07)
SNS_OC.FLT: R238.1 ; port SNS_OC.FLT
SNS_OC.FLT_R: R238.2 U200.H14(PD21)

Not connected (* = marked no-connect by the designer): U200 A4(PC30)* A9(PC27)* B9(PC28)* C1(PC00)* C2(PC01)* H1(PD01)* K14(PC21)* L15(PC20)* M14(PC17)* M15(PC18)* N1(PC04)* N2(PC05)* N15(PC16)* P1(PC06)* P10(PC10)* P11(PC13)* P12(PC15)* R8(PD12)* R9(PC11)* R10(PC12)* R11(PC14)*

### Layout directives
net class ACC_UART: ACC_UART.CTS, ACC_UART.RTS, ACC_UART.RXD, ACC_UART.TXD
net class DRIVER_SPI: DRV_SPI0.CS, DRV_SPI0.MISO, DRV_SPI0.MOSI, DRV_SPI0.SCK
net class DISPLAY_UART: DISPLAY_UART.CTS, DISPLAY_UART.RTS
net class SENSOR_SIGNALS: LEFT_BRAKE_SIG, RIGHT_BRAKE_SIG
net class ACC_CAN: ACC_CAN.TERM

### Notes on the sheet
- ID200 - MCU PERIPHERALS
- ACCESSORY UART
- ClassName: ACC_UART
- HIGH-SIDE DRIVER
- ClassName: DRIVER_SPI
- INPUT SENSORS
- ClassName: SENSOR_SIGNALS
- ACCESSORY CAN
- ClassName: ACC_CAN
- DISPLAY UART
- ClassName: DISPLAY_UART
- OVER-CURRENT SWITCH
- BOARD ID
- DESIGN NOTE:
- Title:
- Size:
- Date:
- A3
- Sheet       of
- Engineer:
- Version:
- Part Number:
- Revision:
- Rev. date:
- Project:
- File:

### Library data of the parts
R228-R231 R233 R235 R237 R238 R242-R244 = 127: as R202 on sheet LIDO-HW.200.MCU_Peripherals_1; Part Value: JUMPER; Part Value 3: 1/10W; Package Type: SMT
R232 R234 R236 R239-R241 = 111: as R208 on sheet LIDO-HW.200.MCU_Peripherals_1; Part Value: 33; Part Value 2: 5%; Part Value 3: 1/10W; Package Type: SMT
R245 R246 = 113: RES 1K OHM 5% 1/10W 0603; Manufacturer Part Number: RC0603JR-071KL; Manufacturer: YAGEO; Obsolete Part: False; Component ID: 113; Part Value: 1K; Part Value 3: 1/10W; Package Type: SMT
R247 R248 = 115: as R132-R134 on sheet LIDO-HW.100.InputStage_2; Part Value: 10K; Part Value 3: 1/10W; Package Type: SMT
U200 = 10: as U200 on sheet LIDO-HW.200.MCU_Peripherals_1; Manufacturer Part Number: ATSAME54P20A-CTUT; Part Type: MCU M4; Package Type: SMT

## Sheet LIDO-HW.200.MCU_SWD_Reset.SchDoc
size A3; SheetNumber: 12; SheetTotal: 17
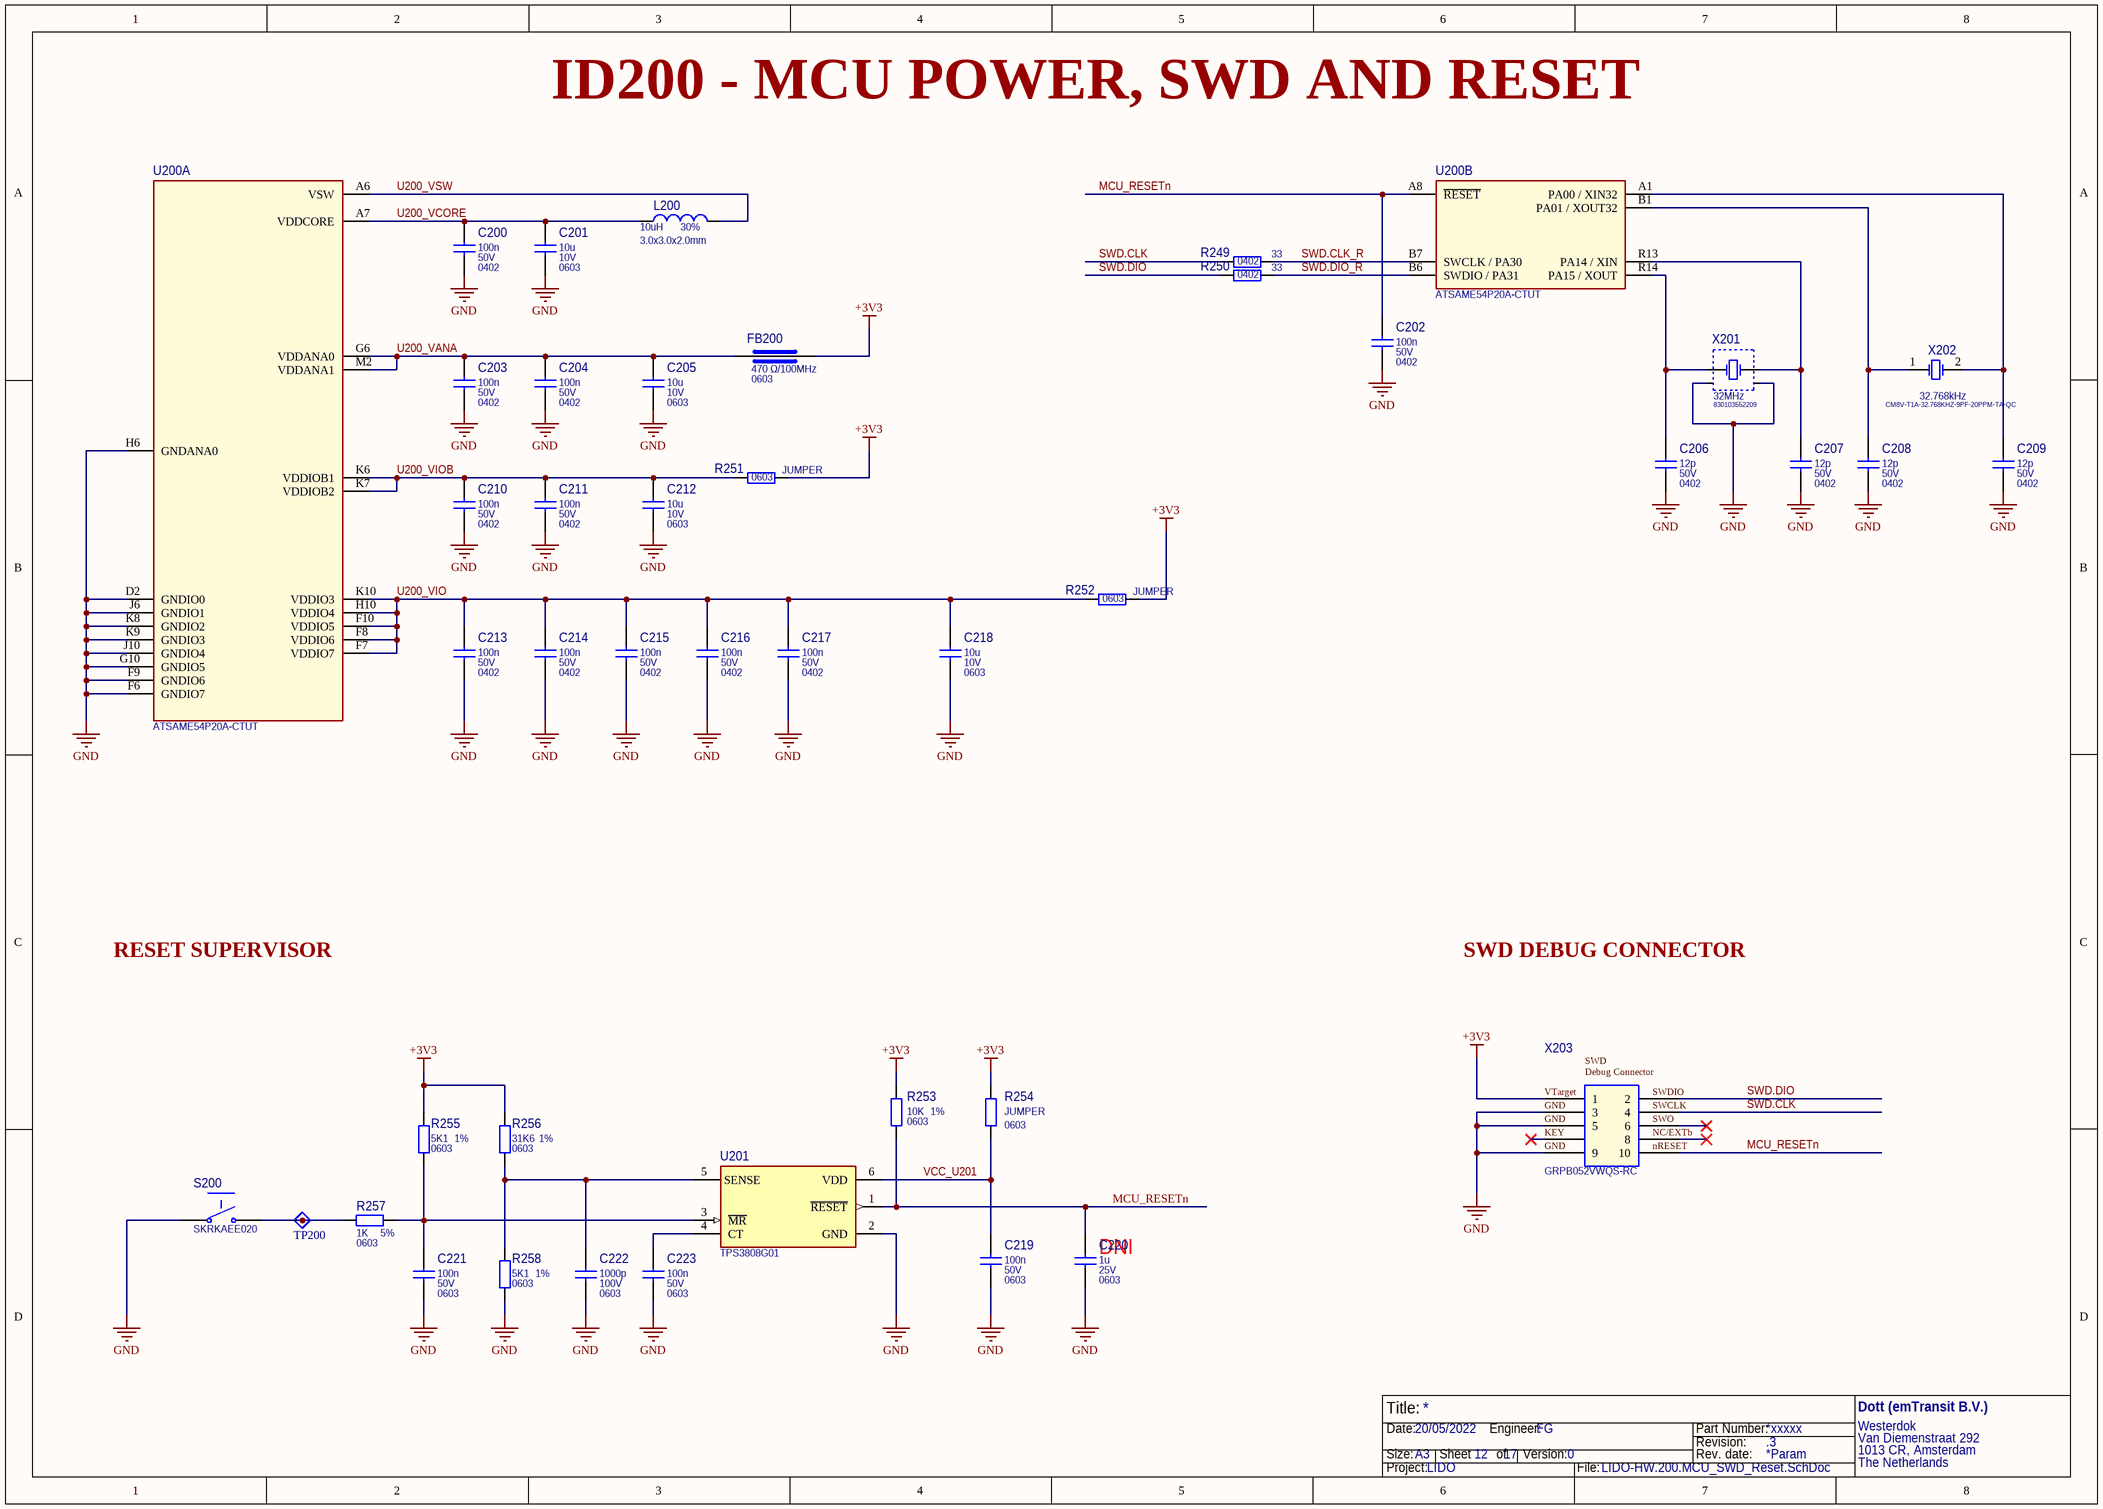
[diagram p11: LIDO-HW.200.MCU_SWD_Reset.SchDoc]

### Parts
C200  100n  Part Value 2: 50V  Part Package: 0402  [CAP_0402_1005X60-N_MURATA_A]
C201  10u  Part Value 2: 10V  Part Package: 0603  [CAP_0603_1608X90-N_MURATA_A]
C202  100n  Part Value 2: 50V  Part Package: 0402  [CAP_0402_1005X60-N_MURATA_A]
C203  100n  Part Value 2: 50V  Part Package: 0402  [CAP_0402_1005X60-N_MURATA_A]
C204  100n  Part Value 2: 50V  Part Package: 0402  [CAP_0402_1005X60-N_MURATA_A]
C205  10u  Part Value 2: 10V  Part Package: 0603  [CAP_0603_1608X90-N_MURATA_A]
C206  12p  Part Value 2: 50V  Part Package: 0402  [CAP_0402_1005X60-N_MURATA_A]
C207  12p  Part Value 2: 50V  Part Package: 0402  [CAP_0402_1005X60-N_MURATA_A]
C208  12p  Part Value 2: 50V  Part Package: 0402  [CAP_0402_1005X60-N_MURATA_A]
C209  12p  Part Value 2: 50V  Part Package: 0402  [CAP_0402_1005X60-N_MURATA_A]
C210  100n  Part Value 2: 50V  Part Package: 0402  [CAP_0402_1005X60-N_MURATA_A]
C211  100n  Part Value 2: 50V  Part Package: 0402  [CAP_0402_1005X60-N_MURATA_A]
C212  10u  Part Value 2: 10V  Part Package: 0603  [CAP_0603_1608X90-N_MURATA_A]
C213  100n  Part Value 2: 50V  Part Package: 0402  [CAP_0402_1005X60-N_MURATA_A]
C214  100n  Part Value 2: 50V  Part Package: 0402  [CAP_0402_1005X60-N_MURATA_A]
C215  100n  Part Value 2: 50V  Part Package: 0402  [CAP_0402_1005X60-N_MURATA_A]
C216  100n  Part Value 2: 50V  Part Package: 0402  [CAP_0402_1005X60-N_MURATA_A]
C217  100n  Part Value 2: 50V  Part Package: 0402  [CAP_0402_1005X60-N_MURATA_A]
C218  10u  Part Value 2: 10V  Part Package: 0603  [CAP_0603_1608X90-N_MURATA_A]
C219  100n  Part Value 2: 50V  Part Package: 0603  [CAP_0603_1608X90-N_MURATA_A]
C220  1u  Part Value 2: 25V  Part Package: 0603  [CAP_0603_1608X90-N_MURATA_A]
C221  100n  Part Value 2: 50V  Part Package: 0603  [CAP_0603_1608X90-N_MURATA_A]
C222  1000p  Part Value 2: 100V  Part Package: 0603  [CAP_0603_1608X90-N_MURATA_A]
C223  100n  Part Value 2: 50V  Part Package: 0603  [CAP_0603_1608X90-N_MURATA_A]
FB200  470 Ω/100MHz  Part Package: 0603  [IND_0603_1608X95-N_AVX_A]
L200  10uH  Part Value 2: 30%  Part Package: 3.0x3.0x2.0mm  [SUMIDA_CDRH2D18_HP_A]
R249  33  Part Package: 0402  [RES_0402_1005X40-N_YAGEO_A]
R250  33  Part Package: 0402  [RES_0402_1005X40-N_YAGEO_A]
R251  JUMPER  Part Package: 0603  [RES_0603_1608X60-N_YAGEO_A]
R252  JUMPER  Part Package: 0603  [RES_0603_1608X60-N_YAGEO_A]
R253  10K  Part Value 2: 1%  Part Package: 0603  [RES_0603_1608X60-N_YAGEO_A]
R254  JUMPER  Part Package: 0603  [RES_0603_1608X60-N_YAGEO_A]
R255  5K1  Part Value 2: 1%  Part Package: 0603  [RES_0603_1608X60-N_YAGEO_A]
R256  31K6  Part Value 2: 1%  Part Package: 0603  [RES_0603_1608X60-N_YAGEO_A]
R257  1K  Part Value 2: 5%  Part Package: 0603  [RES_0603_1608X60-N_YAGEO_A]
R258  5K1  Part Value 2: 1%  Part Package: 0603  [RES_0603_1608X60-N_YAGEO_A]
S200  SKRKAEE020  [ALPS_SKRKA_390X290X200_A]
TP200  TestPoint_A  [TESTPOINT_1D_A]  (value not drawn)  (no BOM)
U200  ATSAME54P20A-CTUT  [BGA120CP50_15X15_800X800X120B25-N_MICROCHIP_A]  (parts A,B of 4)
U201  TPS3808G01  [SOT23-6P95_280X145L45-N_TI_A]
X201  32MHz  Manufacturer Part Number: 830103552209  [IQD_CFPX180_340X270X80_A]
X202  32.768kHz  Manufacturer Part Number: CM8V-T1A-32.768KHZ-9PF-20PPM-TA-QC  [ECS_ECX-12Q_200x120x55_A]
X203  GRPB052VWQS-RC  [SAMTEC_FTSH-105-01-L-DV_A]

### Nets
+3V3: FB200.2 R251.2 R252.2 R253.2 R254.2 R255.2 R256.2 X203.1
GND: C200.2 C201.2 C202.2 C203.2 C204.2 C205.2 C206.2 C207.2 C208.2 C209.2 C210.2 C211.2 C212.2 C213.2 C214.2 C215.2 C216.2 C217.2 C218.2 C219.1 C220.2 C221.1 C222.2 C223.1 R258.1 S200.1 U200.D2(GNDIO0) U200.F6(GNDIO7) U200.F9(GNDIO6) U200.G10(GNDIO5) U200.H6(GNDANA0) U200.J6(GNDIO1) U200.J10(GNDIO4) U200.K8(GNDIO2) U200.K9(GNDIO3) U201.2(GND) X201.2(GND) X201.4(GND) X203.3 X203.5 X203.9
MCU_RESETn: C202.1 C220.1 R253.1 U200.A8(~{RESET}) U201.1(~{RESET}) X203.10
SWD.CLK: R249.1 X203.4
SWD.CLK_R: R249.2 U200.B7(SWCLK_/_PA30)
SWD.DIO: R250.1 X203.2
SWD.DIO_R: R250.2 U200.B6(SWDIO_/_PA31)
U200_VANA: C203.1 C204.1 C205.1 FB200.1 U200.G6(VDDANA0) U200.M2(VDDANA1)
U200_VCORE: C200.1 C201.1 L200.1 U200.A7(VDDCORE)
U200_VIO: C213.1 C214.1 C215.1 C216.1 C217.1 C218.1 R252.1 U200.F7(VDDIO7) U200.F8(VDDIO6) U200.F10(VDDIO5) U200.H10(VDDIO4) U200.K10(VDDIO3)
U200_VIOB: C210.1 C211.1 C212.1 R251.1 U200.K6(VDDIOB1) U200.K7(VDDIOB2)
U200_VSW: L200.2 U200.A6(VSW)
VCC_U201: C219.2 R254.1 U201.6(VDD)
NetC206_1: C206.1 U200.R14(PA15_/_XOUT) X201.1(OSC1)
NetC207_1: C207.1 U200.R13(PA14_/_XIN) X201.3(OSC2)
NetC208_1: C208.1 U200.B1(PA01_/_XOUT32) X202.1(OSC1)
NetC209_1: C209.1 U200.A1(PA00_/_XIN32) X202.2(OSC2)
NetC221_2: C221.2 R255.1 R257.1 U201.3(~{MR})
NetC222_1: C222.1 R256.1 R258.2 U201.5(SENSE)
NetC223_2: C223.2 U201.4(CT)
NetR257_2: R257.2 S200.2 TP200.1(TP)

Not connected (* = marked no-connect by the designer): X203 6* 7* 8*

### Notes on the sheet
- ID200 - MCU POWER, SWD AND RESET
- RESET SUPERVISOR
- SWD DEBUG CONNECTOR
- Title:
- Size:
- Date:
- A3
- Sheet       of
- Engineer:
- Version:
- Part Number:
- Revision:
- Rev. date:
- Project:
- File:
- (in symbol 52) SWD; Debug Connector; VTarget; SWDIO; GND; SWCLK; SWO; KEY; NC/EXTb; nRESET

### Library data of the parts
C200 C202-C204 C210 C211 C213-C217 = 93: CAP CER 0.1UF 50V X7R 0402; Manufacturer Part Number: GCM155R71H104KE02D; Manufacturer: Murata Electronics; Obsolete Part: False; Component ID: 93; Part Value: 100n; Part Value 3: X7R; Package Type: SMT
C201 C205 C212 C218 = 94: CAP CER 10UF 10V X7R 0603; Manufacturer Part Number: GRM188Z71A106KA73D; Manufacturer: Murata Electronics; Obsolete Part: False; Component ID: 94; Part Value: 10u; Part Value 3: X7R; Package Type: SMT
C206-C209 = 95: CAP CER 12PF 50V C0G/NP0 0402; Manufacturer Part Number: GJM1555C1H120FB01D; Manufacturer: Murata Electronics; Obsolete Part: False; Component ID: 95; Part Value: 12p; Part Value 3: C0G; Package Type: SMT
C219 C221 C223 = 77: as C160 on sheet LIDO-HW.100.OutputStage; Part Value: 100n; Part Value 3: X7R; Package Type: SMT
C220 = 78: as C154 on sheet LIDO-HW.100.InputStage_2; Part Value: 1u; Part Value 3: X7R; Package Type: SMT
C222 = 84: CAP CER 1000PF 100V X7R 0603; Manufacturer Part Number: CGA3E2X7R2A102K080AA; Manufacturer: TDK Corporation; Obsolete Part: False; Component ID: 84; Part Value: 1000p; Part Value 3: X7R; Package Type: SMT
FB200 = 19: FERRITE BEAD 470 OHM 0603 1LN; Manufacturer Part Number: BLM18PG471SN1D; Manufacturer: Murata Electronics; Obsolete Part: False; Component ID: 19; Part Type: Ferrite Beads; Part Value: 470 Ω/100MHz; Part Value 2: 1A; Package Type: SMT
L200 = 26: FIXED IND 10UH 900MA 245MOHM SMD; Manufacturer Part Number: CDRH2D18/HPNP-100NC; Manufacturer: Sumida America Components Inc.; Obsolete Part: False; Component ID: 26; Part Value: 10uH; Part Value 3: 900mA; Package Type: SMT
R249 R250 = 111: as R208 on sheet LIDO-HW.200.MCU_Peripherals_1; Part Value: 33; Part Value 2: 5%; Part Value 3: 1/10W; Package Type: SMT
R251 R252 R254 = 9: as R138 on sheet LIDO-HW.100.InputStage_2; Part Value: JUMPER; Part Value 2: 5%; Part Value 3: 1/10W; Package Type: SMT
R253 = 115: as R132-R134 on sheet LIDO-HW.100.InputStage_2; Part Value: 10K; Part Value 3: 1/10W; Package Type: SMT
R255 R258 = 122: RES SMD 5.1K OHM 1% 1/10W 0603; Manufacturer Part Number: ERJ-3EKF5101V; Manufacturer: Panasonic Electronic Components; Obsolete Part: False; Component ID: 122; Part Value: 5K1; Part Value 3: 1/10W; Package Type: SMT
R256 = 123: RES 31.6K OHM 1% 1/10W 0603; Manufacturer Part Number: RC0603FR-0731K6L; Manufacturer: YAGEO; Obsolete Part: False; Component ID: 123; Part Value: 31K6; Part Value 3: 1/10W; Package Type: SMT
R257 = 113: as R245 on sheet LIDO-HW.200.MCU_Peripherals_2; Part Value: 1K; Part Value 3: 1/10W; Package Type: SMT
S200 = 4: Switch Tactile N.O. SPST Round Button Gull Wing 0.05A 12VDC 1.57N SMD T/R; Manufacturer: Alps Alpine; Obsolete Part: False; Component ID: 4; Manufacturer Part Number: SKRKAEE020; Part Type: Push-Button; Package Type: SMT
TP200 = 3: as TP113-TP119 on sheet LIDO-HW.100.InputStage_2; 02_Layer: *; 01_Diameter: 1mm
U200 = 10: as U200 on sheet LIDO-HW.200.MCU_Peripherals_1; Manufacturer Part Number: ATSAME54P20A-CTUT; Part Type: MCU M4; Package Type: SMT
U201 = 36: Supervisor Open Drain or Open Collector 1 Channel SOT-23-6; Manufacturer: Texas Instruments; Manufacturer Part Number: TPS3808G01DBVR; Part Package: SOT23-6; Obsolete Part: False; Designer: Matt Drazenovich; Ratings: RoHS; Reviewed: Dekimo_30-06-2020; Component ID: 36; Case/Package: SOT-23-6; ComponentType: IC; Design Date: 04-11-2019; Max Operating Temperature: 125°C; Min Operating Temperature: -40°C; Value: TPS3808G01; Part Type: Supervisor; Package Type: SMT
X201 = 18: 32 MHz ±10ppm Crystal 9pF 40 Ohms 4-SMD, No Lead; Manufacturer: Würth Elektronik; Part Package: SMD-4; Obsolete Part: False; Component ID: 18; Part Value: 32MHz; Package Type: SMT
X202 = 17: 32.768 kHz ±20ppm Crystal 9pF 70 kOhms 2-SMD, No Lead; Manufacturer: Micro Crystal AG; Part Package: SMD-2; Obsolete Part: False; Component ID: 17; Part Value: 32.768kHz; Package Type: SMT
X203 = 52: CONN HEADER SMD 10POS 1.27MM; Manufacturer: Sullins Connector Solutions; Part Value: 10-Pins; Obsolete Part: False; Component ID: 52; Manufacturer Part Number: GRPB052VWQS-RC; Part Type: SWD  CONN; Part Pitch: 1.27mm

## Sheet LIDO-HW.200.SecurityAndTemperature.SchDoc
size A3; SheetNumber: 13; SheetTotal: 17
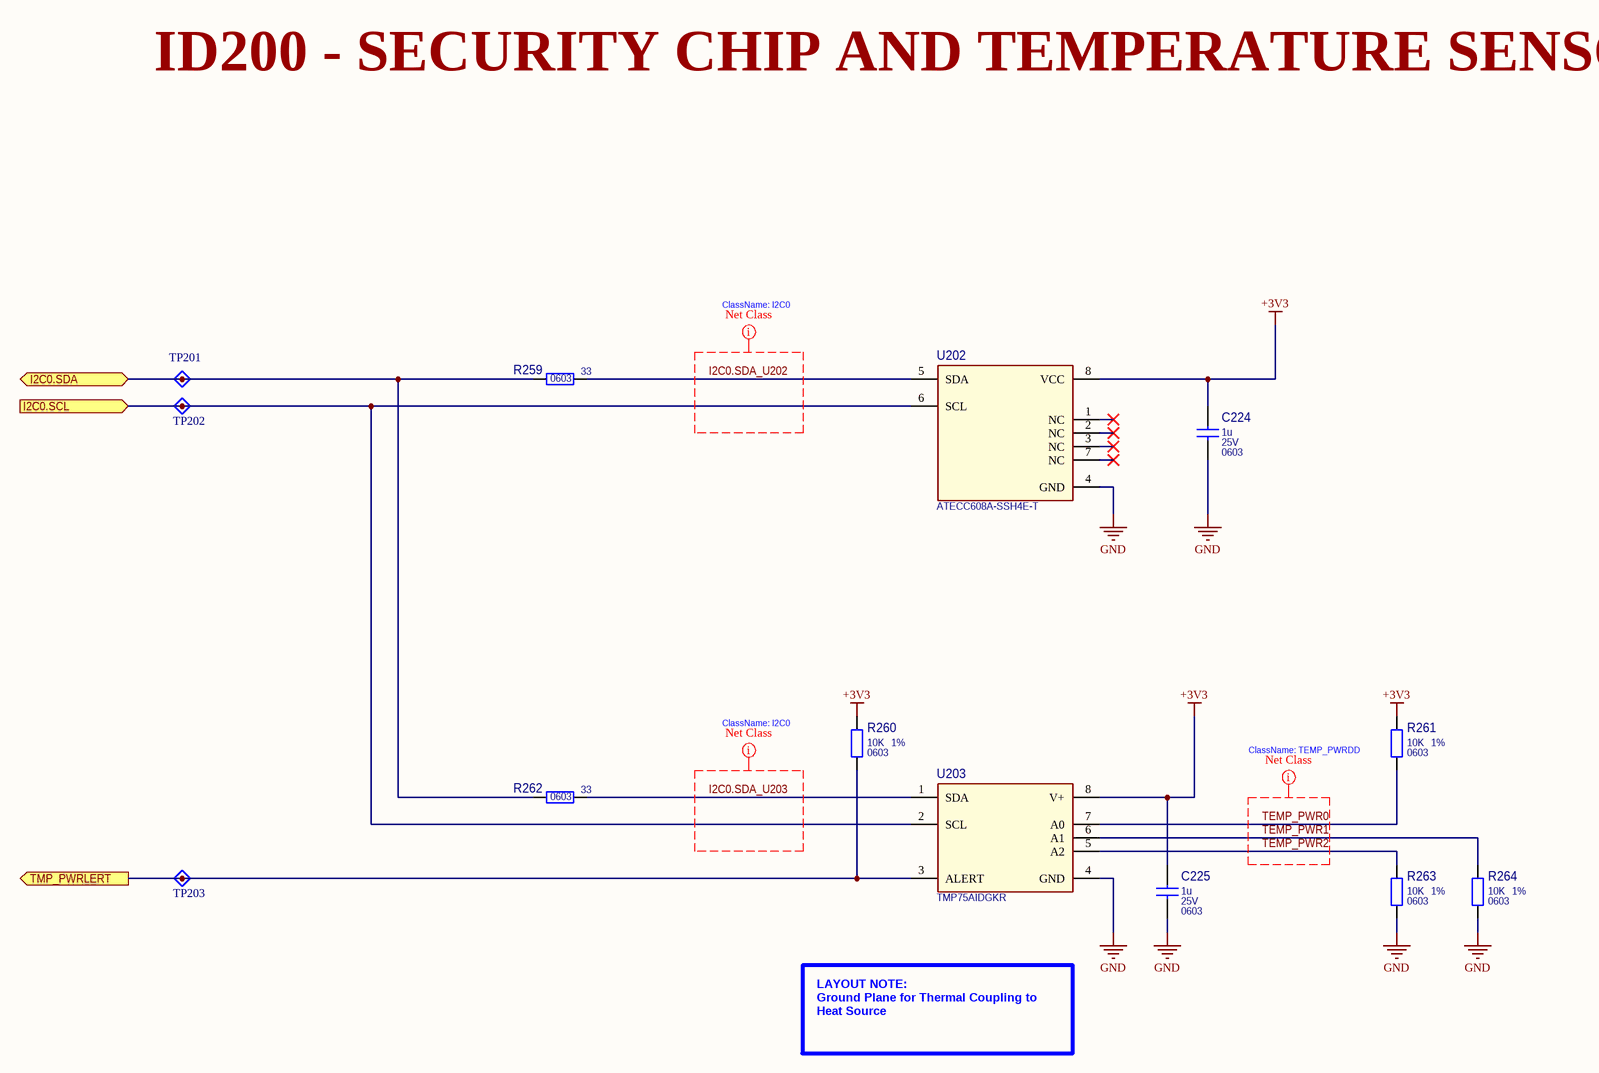
[diagram p12: LIDO-HW.200.SecurityAndTemperature.SchDoc]

### Parts
C224  1u  Part Value 2: 25V  Part Package: 0603  [CAP_0603_1608X90-N_MURATA_A]
C225  1u  Part Value 2: 25V  Part Package: 0603  [CAP_0603_1608X90-N_MURATA_A]
R259  33  Part Package: 0603  [RES_0603_1608X60-N_YAGEO_A]
R260  10K  Part Value 2: 1%  Part Package: 0603  [RES_0603_1608X60-N_YAGEO_A]
R261  10K  Part Value 2: 1%  Part Package: 0603  [RES_0603_1608X60-N_YAGEO_A]
R262  33  Part Package: 0603  [RES_0603_1608X60-N_YAGEO_A]
R263  10K  Part Value 2: 1%  Part Package: 0603  [RES_0603_1608X60-N_YAGEO_A]
R264  10K  Part Value 2: 1%  Part Package: 0603  [RES_0603_1608X60-N_YAGEO_A]
TP201  TestPoint_A  [TESTPOINT_1D_A]  (value not drawn)  (no BOM)
TP202  TestPoint_A  [TESTPOINT_1D_A]  (value not drawn)  (no BOM)
TP203  TestPoint_A  [TESTPOINT_1D_A]  (value not drawn)  (no BOM)
U202  ATECC608A-SSH4E-T  [SOIC8P127_490X600X175L84X41-N_TI_A]
U203  TMP75AIDGKR  [VSSOP8P65_300X490X110L55X32-N_TI_A]

### Ports
I2C0.SCL (in), I2C0.SDA (bidir), TMP_PWRLERT (out)

### Nets
+3V3: C224.1 C225.1 R260.2 R261.2 U202.8(VCC) U203.8(V+)
GND: C224.2 C225.2 R263.1 R264.1 U202.4(GND) U203.4(GND)
I2C0.SCL: TP202.1(TP) U202.6(SCL) U203.2(SCL) ; port I2C0.SCL
I2C0.SDA: R259.1 R262.1 TP201.1(TP) ; port I2C0.SDA
I2C0.SDA_U202: R259.2 U202.5(SDA)
I2C0.SDA_U203: R262.2 U203.1(SDA)
TEMP_PWR0: R261.1 U203.7(A0)
TEMP_PWR1: R264.2 U203.6(A1)
TEMP_PWR2: R263.2 U203.5(A2)
TMP_PWRLERT: R260.1 TP203.1(TP) U203.3(ALERT) ; port TMP_PWRLERT

Not connected (* = marked no-connect by the designer): U202 1(NC)* 2(NC)* 3(NC)* 7(NC)*

### Layout directives
net class I2C0: I2C0.SDA_U202, I2C0.SDA_U203
net class TEMP_PWRDD: TEMP_PWR0, TEMP_PWR1, TEMP_PWR2

### Notes on the sheet
- ID200 - SECURITY CHIP AND TEMPERATURE SENSOR
- ClassName: I2C0
- (near R261) ClassName: TEMP_PWRDD
- LAYOUT NOTE:
  Ground Plane for Thermal Coupling to Heat Source
- Title:
- Size:
- Date:
- A3
- Sheet       of
- Engineer:
- Version:
- Part Number:
- Revision:
- Rev. date:
- Project:
- File:

### Library data of the parts
C224 C225 = 78: as C154 on sheet LIDO-HW.100.InputStage_2; Part Value: 1u; Part Value 3: X7R; Package Type: SMT
R259 R262 = 121: as R167 on sheet LIDO-HW.100.OutputStage; Part Value: 33; Part Value 2: 5%; Part Value 3: 1/10W; Package Type: SMT
R260 R261 R263 R264 = 115: as R132-R134 on sheet LIDO-HW.100.InputStage_2; Part Value: 10K; Part Value 3: 1/10W; Package Type: SMT
TP201-TP203 = 3: as TP113-TP119 on sheet LIDO-HW.100.InputStage_2; 02_Layer: *; 01_Diameter: 1mm
U202 = 1: IC AUTHENTICATION CHIP 8SOIC; Manufacturer: Microchip Technology; Part Package: SOIC-8; Obsolete Part: False; Designer: Dekimo; Ratings: RoHS; Reviewed: Dekimo_30-06-2020; Component ID: 1; Case/Package: 8-SOIC; ComponentType: IC; Design Date: N/A; Manufacturer Part Number: ATECC608A-SSH4E-T; Max Operating Temperature: 85°C; Min Operating Temperature: -40°C; Value: ATECC608A-SSH4E-T; Package Type: SMT
U203 = 3: Temperature Sensor Digital, Local -40°C ~ 125°C 11 b 8-VSSOP; Manufacturer: Texas Instruments; Part Package: VSSOP-8; Part Value: TMP75A; Obsolete Part: False; Designer: Matt Drazenovich; Ratings: RoHS; Reviewed: Dekimo_07-07-2020; Component ID: 3; Case/Package: 8-VSSOP; ComponentType: IC; Manufacturer Part Number: TMP75AIDGKR; Max Operating Temperature: 127°C; Min Operating Temperature: -40°C; Value: TMP75AIDGKR; Design Date: 03-07-2020; Package Type: SMT

## Sheet LIDO-HW.300.VehicleInterface.SchDoc
size A3; SheetNumber: 14; SheetTotal: 17
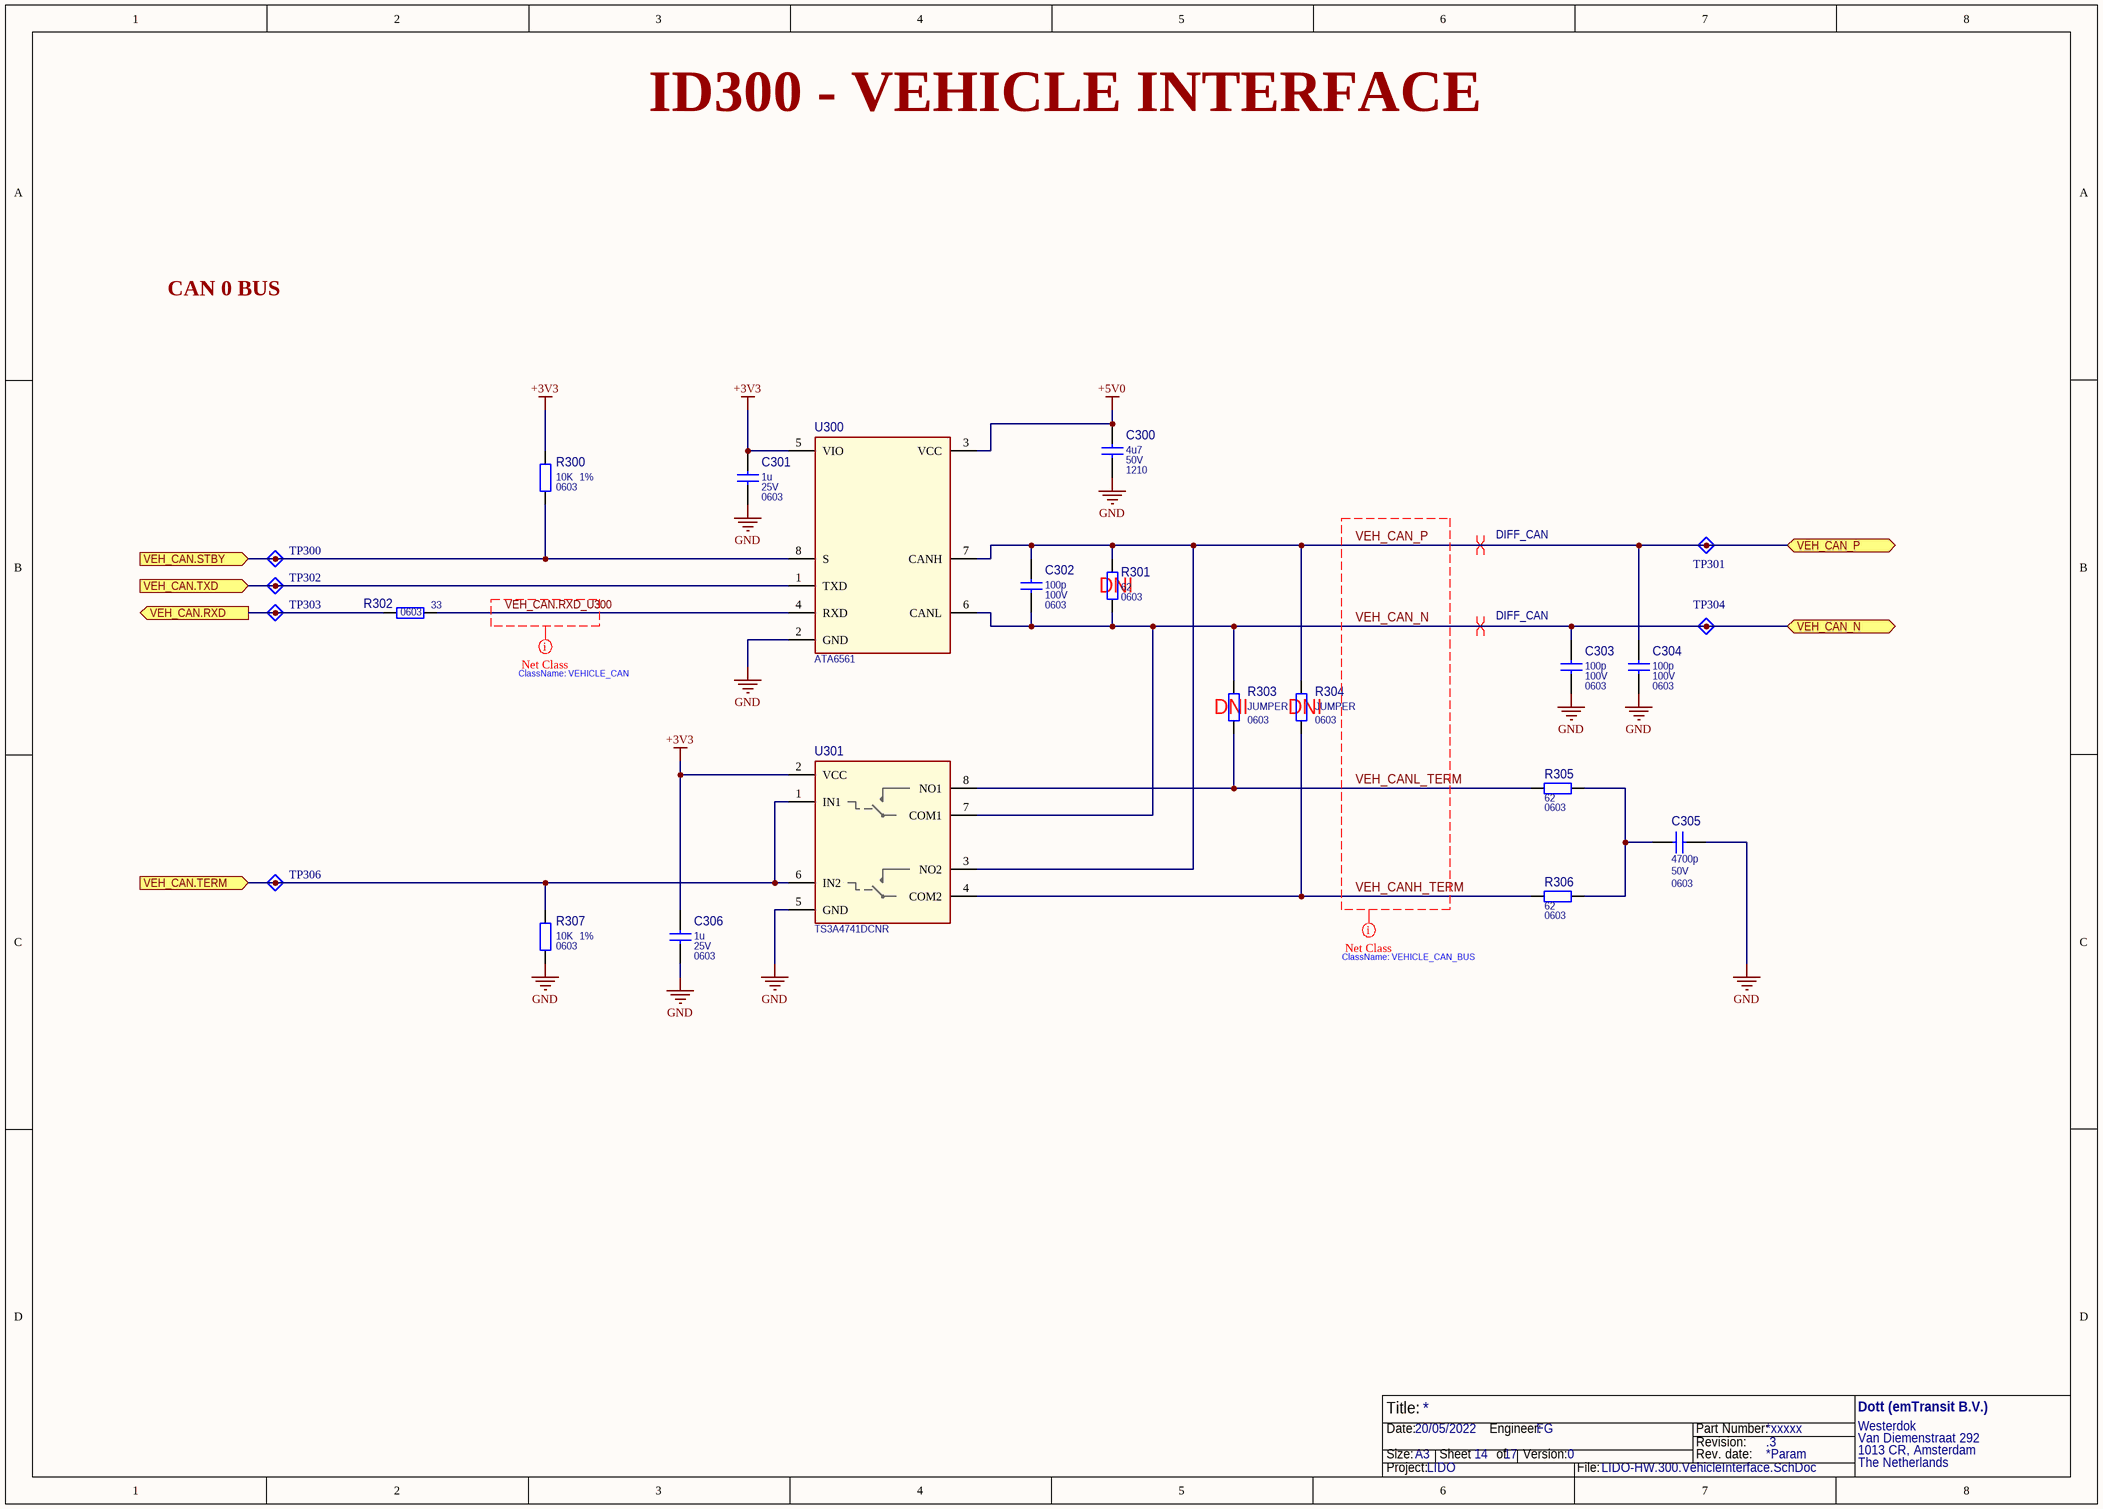
[diagram p13: LIDO-HW.300.VehicleInterface.SchDoc]

### Parts
C300  4u7  Part Value 2: 50V  Part Package: 1210  [CAP_1210_3225X180-N_MURATA_A]
C301  1u  Part Value 2: 25V  Part Package: 0603  [CAP_0603_1608X90-N_MURATA_A]
C302  100p  Part Value 2: 100V  Part Package: 0603  [CAP_0603_1608X90-N_MURATA_A]
C303  100p  Part Value 2: 100V  Part Package: 0603  [CAP_0603_1608X90-N_MURATA_A]
C304  100p  Part Value 2: 100V  Part Package: 0603  [CAP_0603_1608X90-N_MURATA_A]
C305  4700p  Part Value 2: 50V  Part Package: 0603  [CAP_0603_1608X90-N_MURATA_A]
C306  1u  Part Value 2: 25V  Part Package: 0603  [CAP_0603_1608X90-N_MURATA_A]
R300  10K  Part Value 2: 1%  Part Package: 0603  [RES_0603_1608X60-N_YAGEO_A]
R301  62  Part Package: 0603  [RES_0603_1608X60-N_YAGEO_A]
R302  33  Part Package: 0603  [RES_0603_1608X60-N_YAGEO_A]
R303  JUMPER  Part Package: 0603  [RES_0603_1608X60-N_YAGEO_A]
R304  JUMPER  Part Package: 0603  [RES_0603_1608X60-N_YAGEO_A]
R305  62  Part Package: 0603  [RES_0603_1608X60-N_YAGEO_A]
R306  62  Part Package: 0603  [RES_0603_1608X60-N_YAGEO_A]
R307  10K  Part Value 2: 1%  Part Package: 0603  [RES_0603_1608X60-N_YAGEO_A]
TP300  TestPoint_A  [TESTPOINT_1D_A]  (value not drawn)  (no BOM)
TP301  TestPoint_A  [TESTPOINT_1D_A]  (value not drawn)  (no BOM)
TP302  TestPoint_A  [TESTPOINT_1D_A]  (value not drawn)  (no BOM)
TP303  TestPoint_A  [TESTPOINT_1D_A]  (value not drawn)  (no BOM)
TP304  TestPoint_A  [TESTPOINT_1D_A]  (value not drawn)  (no BOM)
TP306  TestPoint_A  [TESTPOINT_1D_A]  (value not drawn)  (no BOM)
U300  ATA6561  [SOIC8P127_490X600X175L84X41-N_TI_A]
U301  TS3A4741DCNR  [SOT23-8P65_280X145L45-N_TI_A]

### Ports
VEH_CAN.RXD (out), VEH_CAN.STBY (in), VEH_CAN.TERM (in), VEH_CAN.TXD (in), VEH_CAN_N (bidir), VEH_CAN_P (bidir)

### Nets
+3V3: C301.1 C306.1 R300.2 U300.5(VIO) U301.2(VCC)
+5V0: C300.1 U300.3(VCC)
GND: C300.2 C301.2 C303.2 C304.2 C305.2 C306.2 R307.1 U300.2(GND) U301.5(GND)
VEH_CAN.RXD: R302.1 TP303.1(TP) ; port VEH_CAN.RXD
VEH_CAN.RXD_U300: R302.2 U300.4(RXD)
VEH_CAN.STBY: R300.1 TP300.1(TP) U300.8(S) ; port VEH_CAN.STBY
VEH_CAN.TERM: R307.2 TP306.1(TP) U301.1(IN1) U301.6(IN2) ; port VEH_CAN.TERM
VEH_CAN.TXD: TP302.1(TP) U300.1(TXD) ; port VEH_CAN.TXD
VEH_CAN_N: C302.2 C303.1 R301.1 R303.2 TP304.1(TP) U300.6(CANL) U301.7(COM1) ; port VEH_CAN_N
VEH_CAN_P: C302.1 C304.1 R301.2 R304.2 TP301.1(TP) U300.7(CANH) U301.3(NO2) ; port VEH_CAN_P
VEH_CANH_TERM: R304.1 R306.1 U301.4(COM2)
VEH_CANL_TERM: R303.1 R305.1 U301.8(NO1)
NetC305_1: C305.1 R305.2 R306.2

### Layout directives
net class VEHICLE_CAN: VEH_CAN.RXD_U300
net class VEHICLE_CAN_BUS: VEH_CAN_N, VEH_CAN_P, VEH_CANH_TERM, VEH_CANL_TERM
differential pair; differential pair class DIFF_CAN: VEH_CAN_N, VEH_CAN_P

### Notes on the sheet
- ID300 - VEHICLE INTERFACE
- CAN 0 BUS
- ClassName: VEHICLE_CAN
- ClassName: VEHICLE_CAN_BUS
- Title:
- Size:
- Date:
- A3
- Sheet       of
- Engineer:
- Version:
- Part Number:
- Revision:
- Rev. date:
- Project:
- File:

### Library data of the parts
C300 = 91: CAP CER 4.7UF 50V X7R 1210; Manufacturer Part Number: CL32B475KBJVPNE; Manufacturer: Samsung Electro-Mechanics; Obsolete Part: False; Component ID: 91; Part Value: 4u7; Part Value 3: X7R; Package Type: SMT
C301 C306 = 78: as C154 on sheet LIDO-HW.100.InputStage_2; Part Value: 1u; Part Value 3: X7R; Package Type: SMT
C302-C304 = 75: CAP CER 100PF 100V C0G 0603; Manufacturer Part Number: CGA3E2C0G2A101J080AA; Manufacturer: TDK Corporation; Obsolete Part: False; Component ID: 75; Part Value: 100p; Part Value 3: 5%; Package Type: SMT
C305 = 85: CAP CER 4700PF 50V X7R 0603; Manufacturer Part Number: CGA3E2X7R1H472K080AA; Manufacturer: TDK Corporation; Obsolete Part: False; Component ID: 85; Part Value: 4700p; Part Value 3: X7R; Package Type: SMT
R300 R307 = 115: as R132-R134 on sheet LIDO-HW.100.InputStage_2; Part Value: 10K; Part Value 3: 1/10W; Package Type: SMT
R301 R305 R306 = 116: RES SMD 62 OHM 1% 1/10W 0603; Manufacturer Part Number: ERJ-3EKF62R0V; Manufacturer: Panasonic Electronic Components; Obsolete Part: False; Component ID: 116; Part Value: 62; Part Value 2: 1%; Part Value 3: 1/10W; Package Type: SMT
R302 = 121: as R167 on sheet LIDO-HW.100.OutputStage; Part Value: 33; Part Value 2: 5%; Part Value 3: 1/10W; Package Type: SMT
R303 R304 = 9: as R138 on sheet LIDO-HW.100.InputStage_2; Part Value: JUMPER; Part Value 2: 5%; Part Value 3: 1/10W; Package Type: SMT
TP300-TP304 TP306 = 3: as TP113-TP119 on sheet LIDO-HW.100.InputStage_2; 02_Layer: *; 01_Diameter: 1mm
U300 = 4: IC TRANSCEIVER 1/1 8SO; Manufacturer: Microchip Technology; Manufacturer Part Number: ATA6561-GAQW; Part Package: SOIC-8; Obsolete Part: False; Designer: Matt Drazenovich; Ratings: RoHS; Reviewed: Dekimo_07-07-2020; Component ID: 4; Case/Package: 8-SOIC; ComponentType: IC; Design Date: 22-11-2019; Max Operating Temperature: 150°C; Min Operating Temperature: -40°C; Value: ATA6561; Part Type: TRANSCEIVER; Package Type: SMT
U301 = 5: IC SWITCH DUAL SPST SOT23-8; Manufacturer: Texas Instruments; Obsolete Part: False; Designer: Matt Drazenovich; Ratings: RoHS; Reviewed: Not Footprint; Component ID: 5; Case/Package: SOT-23-8; ComponentType: IC; Design Date: 09-09-2021; Manufacturer Part Number: TS3A4741DCNR; Max Operating Temperature: 85°C; Min Operating Temperature: -40°C; Value: TS3A4741DCNR; Part Type: ANALOG SWITCH; Part Package: SOT23-8; Package Type: SMT